# Altium project BE-PC_EXP_V100.PrjPcb (part 3 of 4)

## Sheet 15_SOLENOID 2.SchDoc
size 420 x 297 mm; SheetNumber: 24; SheetTotal: 29
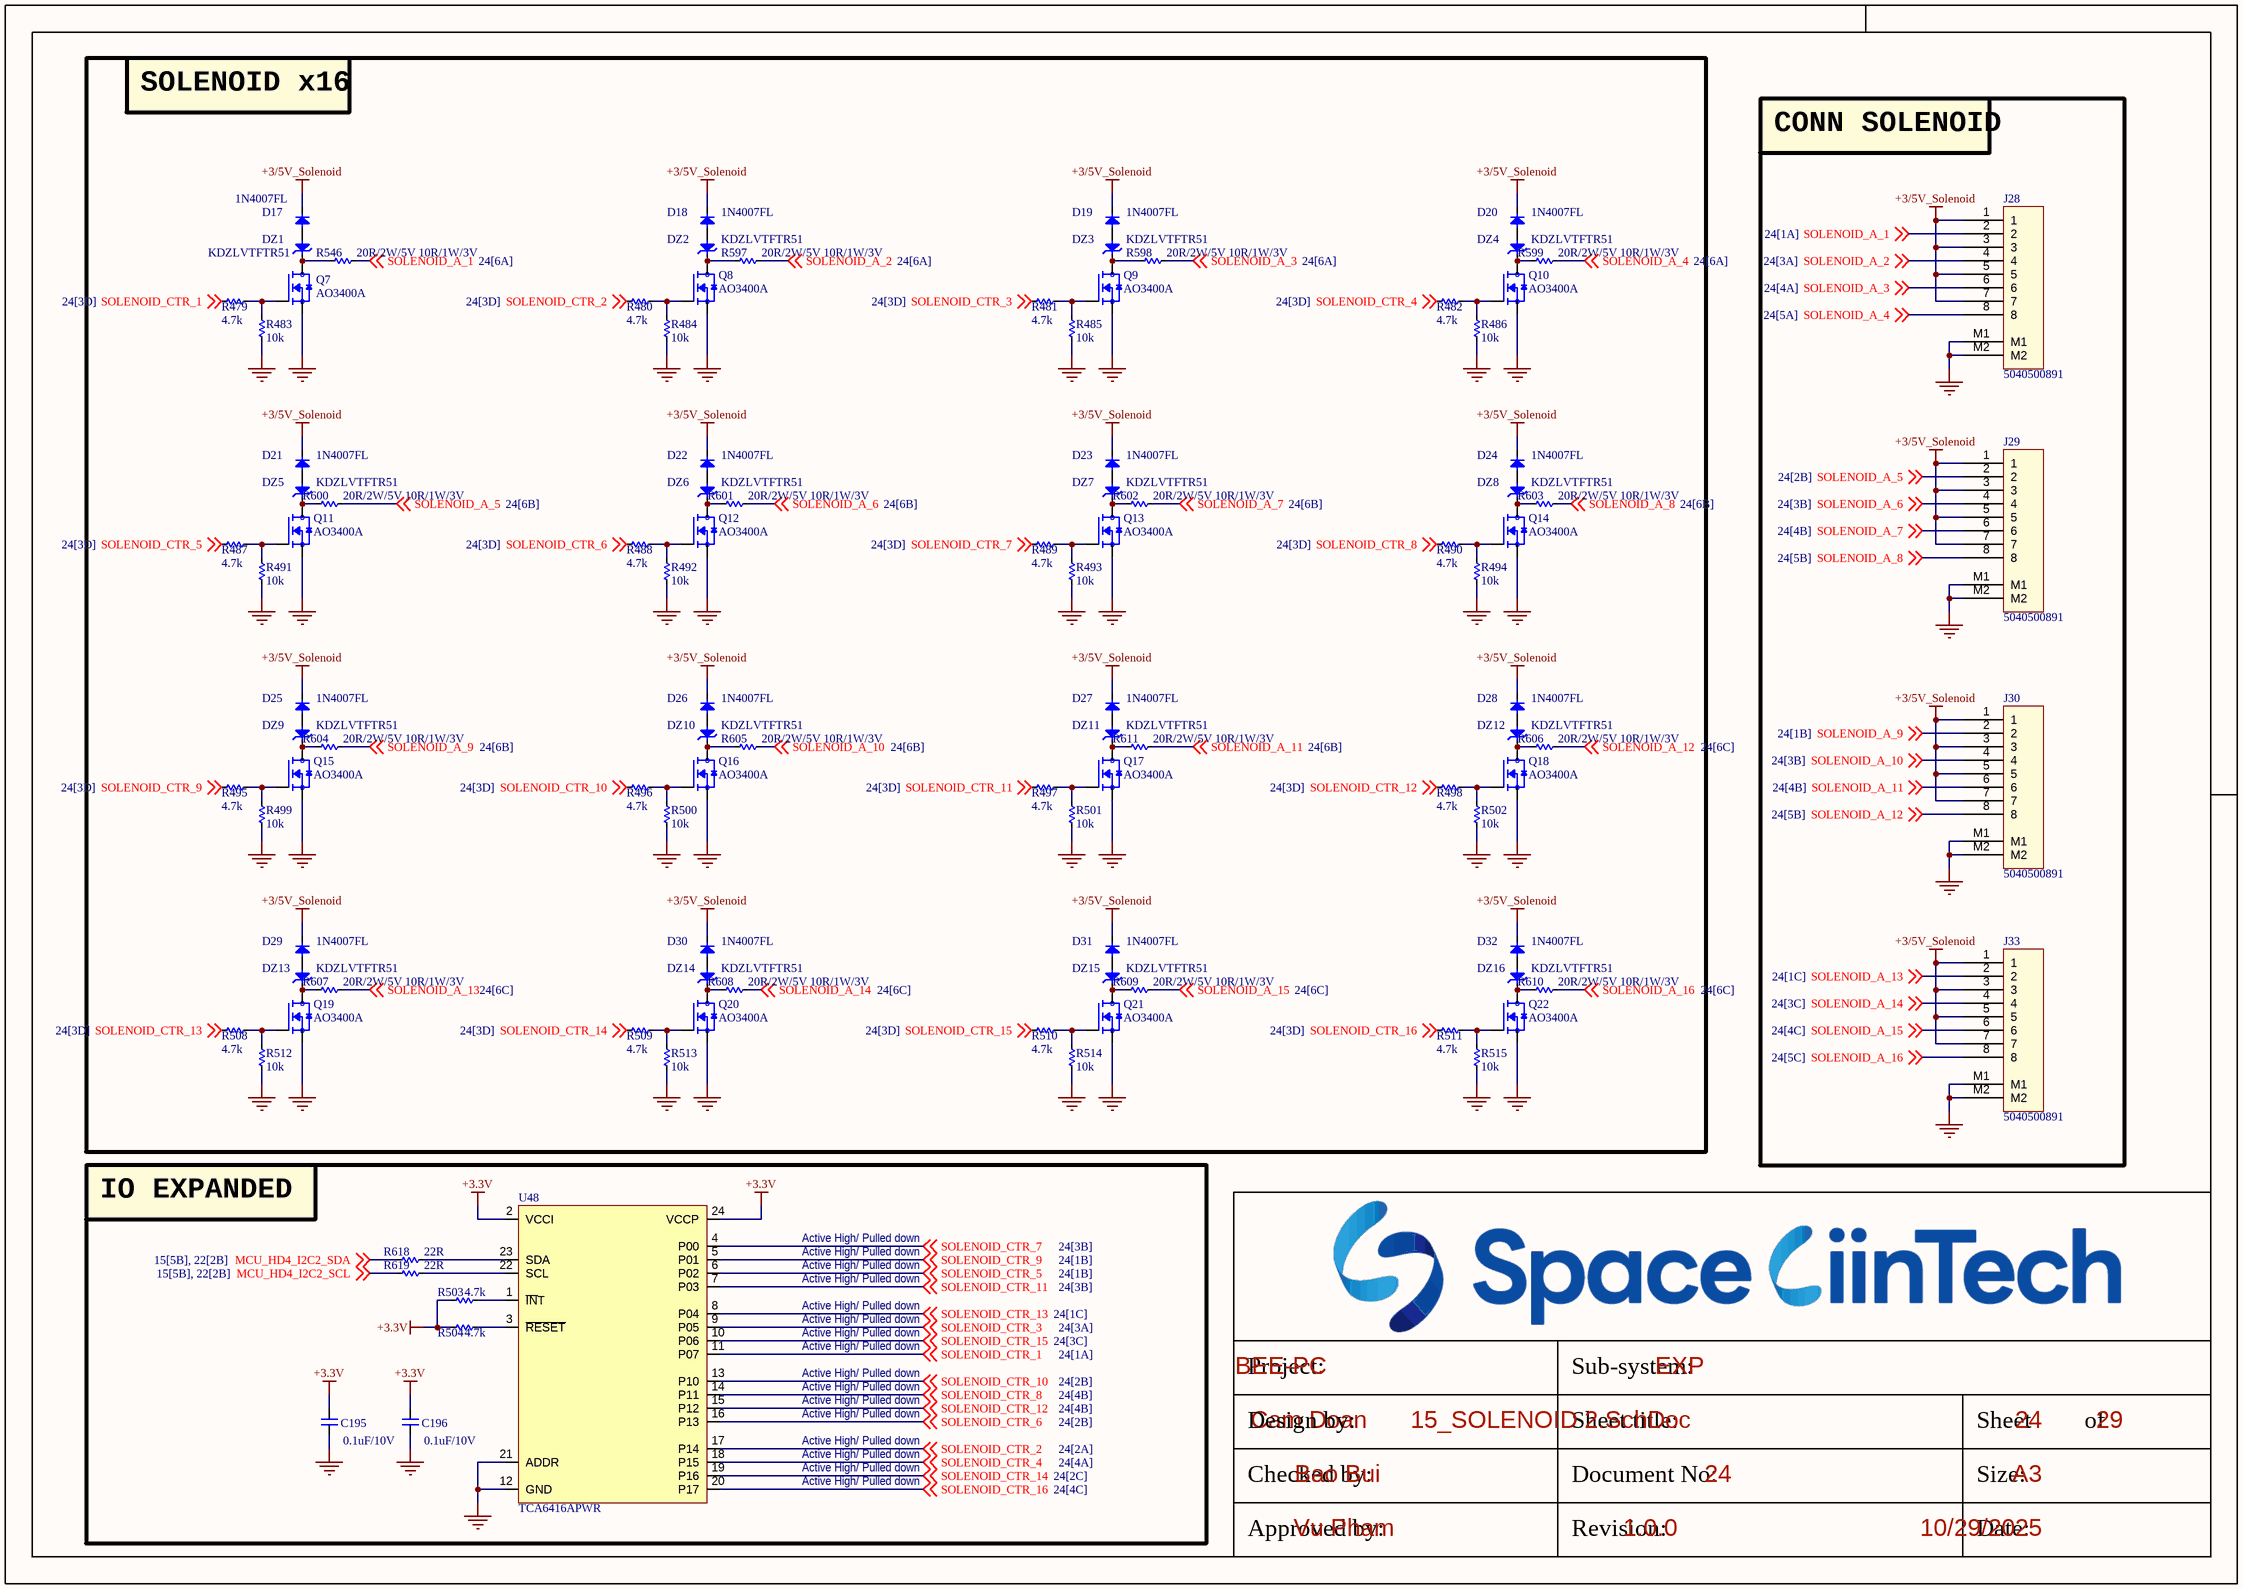
[diagram p25: 15_SOLENOID 2.SchDoc]

### Parts
C195  0.1uF/10V  [CAP_C_1005X60]
C196  0.1uF/10V  [CAP_C_1005X60]
D17  1N4007FL  [SOD3717X145N]
D18  1N4007FL  [SOD3717X145N]
D19  1N4007FL  [SOD3717X145N]
D20  1N4007FL  [SOD3717X145N]
D21  1N4007FL  [SOD3717X145N]
D22  1N4007FL  [SOD3717X145N]
D23  1N4007FL  [SOD3717X145N]
D24  1N4007FL  [SOD3717X145N]
D25  1N4007FL  [SOD3717X145N]
D26  1N4007FL  [SOD3717X145N]
D27  1N4007FL  [SOD3717X145N]
D28  1N4007FL  [SOD3717X145N]
D29  1N4007FL  [SOD3717X145N]
D30  1N4007FL  [SOD3717X145N]
D31  1N4007FL  [SOD3717X145N]
D32  1N4007FL  [SOD3717X145N]
DZ1  KDZLVTFTR51  [SOD3717X145N]
DZ2  KDZLVTFTR51  [SOD3717X145N]
DZ3  KDZLVTFTR51  [SOD3717X145N]
DZ4  KDZLVTFTR51  [SOD3717X145N]
DZ5  KDZLVTFTR51  [SOD3717X145N]
DZ6  KDZLVTFTR51  [SOD3717X145N]
DZ7  KDZLVTFTR51  [SOD3717X145N]
DZ8  KDZLVTFTR51  [SOD3717X145N]
DZ9  KDZLVTFTR51  [SOD3717X145N]
DZ10  KDZLVTFTR51  [SOD3717X145N]
DZ11  KDZLVTFTR51  [SOD3717X145N]
DZ12  KDZLVTFTR51  [SOD3717X145N]
DZ13  KDZLVTFTR51  [SOD3717X145N]
DZ14  KDZLVTFTR51  [SOD3717X145N]
DZ15  KDZLVTFTR51  [SOD3717X145N]
DZ16  KDZLVTFTR51  [SOD3717X145N]
J28  5040500891  [MOLEX_5040500891]
J29  5040500891  [MOLEX_5040500891]
J30  5040500891  [MOLEX_5040500891]
J33  5040500891  [MOLEX_5040500891]
Q7  AO3400A  [SOT95P240X120-3N]
Q8  AO3400A  [SOT95P240X120-3N]
Q9  AO3400A  [SOT95P240X120-3N]
Q10  AO3400A  [SOT95P240X120-3N]
Q11  AO3400A  [SOT95P240X120-3N]
Q12  AO3400A  [SOT95P240X120-3N]
Q13  AO3400A  [SOT95P240X120-3N]
Q14  AO3400A  [SOT95P240X120-3N]
Q15  AO3400A  [SOT95P240X120-3N]
Q16  AO3400A  [SOT95P240X120-3N]
Q17  AO3400A  [SOT95P240X120-3N]
Q18  AO3400A  [SOT95P240X120-3N]
Q19  AO3400A  [SOT95P240X120-3N]
Q20  AO3400A  [SOT95P240X120-3N]
Q21  AO3400A  [SOT95P240X120-3N]
Q22  AO3400A  [SOT95P240X120-3N]
R479  4.7k  [RES_C_1005X40]
R480  4.7k  [RES_C_1005X40]
R481  4.7k  [RES_C_1005X40]
R482  4.7k  [RES_C_1005X40]
R483  10k  [RES_C_1005X40]
R484  10k  [RES_C_1005X40]
R485  10k  [RES_C_1005X40]
R486  10k  [RES_C_1005X40]
R487  4.7k  [RES_C_1005X40]
R488  4.7k  [RES_C_1005X40]
R489  4.7k  [RES_C_1005X40]
R490  4.7k  [RES_C_1005X40]
R491  10k  [RES_C_1005X40]
R492  10k  [RES_C_1005X40]
R493  10k  [RES_C_1005X40]
R494  10k  [RES_C_1005X40]
R495  4.7k  [RES_C_1005X40]
R496  4.7k  [RES_C_1005X40]
R497  4.7k  [RES_C_1005X40]
R498  4.7k  [RES_C_1005X40]
R499  10k  [RES_C_1005X40]
R500  10k  [RES_C_1005X40]
R501  10k  [RES_C_1005X40]
R502  10k  [RES_C_1005X40]
R503  4.7k  [RES_C_1005X40]
R504  4.7k  [RES_C_1005X40]
R508  4.7k  [RES_C_1005X40]
R509  4.7k  [RES_C_1005X40]
R510  4.7k  [RES_C_1005X40]
R511  4.7k  [RES_C_1005X40]
R512  10k  [RES_C_1005X40]
R513  10k  [RES_C_1005X40]
R514  10k  [RES_C_1005X40]
R515  10k  [RES_C_1005X40]
R546  20R/2W/5V 10R/1W/3V  [RES_C_6331X65_N]
R597  20R/2W/5V 10R/1W/3V  [RES_C_6331X65_N]
R598  20R/2W/5V 10R/1W/3V  [RES_C_6331X65_N]
R599  20R/2W/5V 10R/1W/3V  [RES_C_6331X65_N]
R600  20R/2W/5V 10R/1W/3V  [RES_C_6331X65_N]
R601  20R/2W/5V 10R/1W/3V  [RES_C_6331X65_N]
R602  20R/2W/5V 10R/1W/3V  [RES_C_6331X65_N]
R603  20R/2W/5V 10R/1W/3V  [RES_C_6331X65_N]
R604  20R/2W/5V 10R/1W/3V  [RES_C_6331X65_N]
R605  20R/2W/5V 10R/1W/3V  [RES_C_6331X65_N]
R606  20R/2W/5V 10R/1W/3V  [RES_C_6331X65_N]
R607  20R/2W/5V 10R/1W/3V  [RES_C_6331X65_N]
R608  20R/2W/5V 10R/1W/3V  [RES_C_6331X65_N]
R609  20R/2W/5V 10R/1W/3V  [RES_C_6331X65_N]
R610  20R/2W/5V 10R/1W/3V  [RES_C_6331X65_N]
R611  20R/2W/5V 10R/1W/3V  [RES_C_6331X65_N]
R618  22R  [RES_C_1005X40]
R619  22R  [RES_C_1005X40]
U48  TCA6416APWR  [SOP65P440W-24N]

### Blocks framed on the sheet
SOLENOID x16: D17-D32 DZ1-DZ16 Q7-Q22 R479-R502 R508-R515 R546 R597-R611
CONN SOLENOID: J28-J30 J33
IO EXPANDED: C195 C196 R503 R504 R618 R619 U48

### Nets
+3.3V: C195.2 C196.2 R503.1 R504.1 U48.2(VCCI) U48.24(VCCP)
+3/5V_Solenoid: D17.1(K) D18.1(K) D19.1(K) D20.1(K) D21.1(K) D22.1(K) D23.1(K) D24.1(K) D25.1(K) D26.1(K) D27.1(K) D28.1(K) D29.1(K) D30.1(K) D31.1(K) D32.1(K) J28.1 J28.3 J28.5 J28.7 J29.1 J29.3 J29.5 J29.7 J30.1 J30.3 J30.5 J30.7 J33.1 J33.3 J33.5 J33.7
GND: C195.1 C196.1 J28.M1 J28.M2 J29.M1 J29.M2 J30.M1 J30.M2 J33.M1 J33.M2 Q7.2(S) Q8.2(S) Q9.2(S) Q10.2(S) Q11.2(S) Q12.2(S) Q13.2(S) Q14.2(S) Q15.2(S) Q16.2(S) Q17.2(S) Q18.2(S) Q19.2(S) Q20.2(S) Q21.2(S) Q22.2(S) R483.1 R484.1 R485.1 R486.1 R491.1 R492.1 R493.1 R494.1 R499.1 R500.1 R501.1 R502.1 R512.1 R513.1 R514.1 R515.1 U48.12(GND) U48.21(ADDR)
MCU_HD4_I2C2_SCL: R619.2 ; off-sheet MCU_HD4_I2C2_SCL
MCU_HD4_I2C2_SDA: R618.2 ; off-sheet MCU_HD4_I2C2_SDA
SOLENOID_A_1: J28.2 R546.1 ; off-sheet SOLENOID_A_1
SOLENOID_A_2: J28.4 R597.1 ; off-sheet SOLENOID_A_2
SOLENOID_A_3: J28.6 R598.1 ; off-sheet SOLENOID_A_3
SOLENOID_A_4: J28.8 R599.1 ; off-sheet SOLENOID_A_4
SOLENOID_A_5: J29.2 R600.1 ; off-sheet SOLENOID_A_5
SOLENOID_A_6: J29.4 R601.1 ; off-sheet SOLENOID_A_6
SOLENOID_A_7: J29.6 R602.1 ; off-sheet SOLENOID_A_7
SOLENOID_A_8: J29.8 R603.1 ; off-sheet SOLENOID_A_8
SOLENOID_A_9: J30.2 R604.1 ; off-sheet SOLENOID_A_9
SOLENOID_A_10: J30.4 R605.1 ; off-sheet SOLENOID_A_10
SOLENOID_A_11: J30.6 R611.1 ; off-sheet SOLENOID_A_11
SOLENOID_A_12: J30.8 R606.1 ; off-sheet SOLENOID_A_12
SOLENOID_A_13: J33.2 R607.1 ; off-sheet SOLENOID_A_13
SOLENOID_A_14: J33.4 R608.1 ; off-sheet SOLENOID_A_14
SOLENOID_A_15: J33.6 R609.1 ; off-sheet SOLENOID_A_15
SOLENOID_A_16: J33.8 R610.1 ; off-sheet SOLENOID_A_16
SOLENOID_CTR_1: R479.2 U48.11(P07) ; off-sheet SOLENOID_CTR_1
SOLENOID_CTR_2: R480.2 U48.17(P14) ; off-sheet SOLENOID_CTR_2
SOLENOID_CTR_3: R481.2 U48.9(P05) ; off-sheet SOLENOID_CTR_3
SOLENOID_CTR_4: R482.2 U48.18(P15) ; off-sheet SOLENOID_CTR_4
SOLENOID_CTR_5: R487.2 U48.6(P02) ; off-sheet SOLENOID_CTR_5
SOLENOID_CTR_6: R488.2 U48.16(P13) ; off-sheet SOLENOID_CTR_6
SOLENOID_CTR_7: R489.2 U48.4(P00) ; off-sheet SOLENOID_CTR_7
SOLENOID_CTR_8: R490.2 U48.14(P11) ; off-sheet SOLENOID_CTR_8
SOLENOID_CTR_9: R495.2 U48.5(P01) ; off-sheet SOLENOID_CTR_9
SOLENOID_CTR_10: R496.2 U48.13(P10) ; off-sheet SOLENOID_CTR_10
SOLENOID_CTR_11: R497.2 U48.7(P03) ; off-sheet SOLENOID_CTR_11
SOLENOID_CTR_12: R498.2 U48.15(P12) ; off-sheet SOLENOID_CTR_12
SOLENOID_CTR_13: R508.2 U48.8(P04) ; off-sheet SOLENOID_CTR_13
SOLENOID_CTR_14: R509.2 U48.19(P16) ; off-sheet SOLENOID_CTR_14
SOLENOID_CTR_15: R510.2 U48.10(P06) ; off-sheet SOLENOID_CTR_15
SOLENOID_CTR_16: R511.2 U48.20(P17) ; off-sheet SOLENOID_CTR_16
NetD17_2: D17.2(A) DZ1.2(A)
NetD18_2: D18.2(A) DZ2.2(A)
NetD19_2: D19.2(A) DZ3.2(A)
NetD20_2: D20.2(A) DZ4.2(A)
NetD21_2: D21.2(A) DZ5.2(A)
NetD22_2: D22.2(A) DZ6.2(A)
NetD23_2: D23.2(A) DZ7.2(A)
NetD24_2: D24.2(A) DZ8.2(A)
NetD25_2: D25.2(A) DZ9.2(A)
NetD26_2: D26.2(A) DZ10.2(A)
NetD27_2: D27.2(A) DZ11.2(A)
NetD28_2: D28.2(A) DZ12.2(A)
NetD29_2: D29.2(A) DZ13.2(A)
NetD30_2: D30.2(A) DZ14.2(A)
NetD31_2: D31.2(A) DZ15.2(A)
NetD32_2: D32.2(A) DZ16.2(A)
NetDZ1_1: DZ1.1(K) Q7.3(D) R546.2
NetDZ2_1: DZ2.1(K) Q8.3(D) R597.2
NetDZ3_1: DZ3.1(K) Q9.3(D) R598.2
NetDZ4_1: DZ4.1(K) Q10.3(D) R599.2
NetDZ5_1: DZ5.1(K) Q11.3(D) R600.2
NetDZ6_1: DZ6.1(K) Q12.3(D) R601.2
NetDZ7_1: DZ7.1(K) Q13.3(D) R602.2
NetDZ8_1: DZ8.1(K) Q14.3(D) R603.2
NetDZ9_1: DZ9.1(K) Q15.3(D) R604.2
NetDZ10_1: DZ10.1(K) Q16.3(D) R605.2
NetDZ11_1: DZ11.1(K) Q17.3(D) R611.2
NetDZ12_1: DZ12.1(K) Q18.3(D) R606.2
NetDZ13_1: DZ13.1(K) Q19.3(D) R607.2
NetDZ14_1: DZ14.1(K) Q20.3(D) R608.2
NetDZ15_1: DZ15.1(K) Q21.3(D) R609.2
NetDZ16_1: DZ16.1(K) Q22.3(D) R610.2
NetQ7_1: Q7.1(G) R479.1 R483.2
NetQ8_1: Q8.1(G) R480.1 R484.2
NetQ9_1: Q9.1(G) R481.1 R485.2
NetQ10_1: Q10.1(G) R482.1 R486.2
NetQ11_1: Q11.1(G) R487.1 R491.2
NetQ12_1: Q12.1(G) R488.1 R492.2
NetQ13_1: Q13.1(G) R489.1 R493.2
NetQ14_1: Q14.1(G) R490.1 R494.2
NetQ15_1: Q15.1(G) R495.1 R499.2
NetQ16_1: Q16.1(G) R496.1 R500.2
NetQ17_1: Q17.1(G) R497.1 R501.2
NetQ18_1: Q18.1(G) R498.1 R502.2
NetQ19_1: Q19.1(G) R508.1 R512.2
NetQ20_1: Q20.1(G) R509.1 R513.2
NetQ21_1: Q21.1(G) R510.1 R514.2
NetQ22_1: Q22.1(G) R511.1 R515.2
NetR503_2: R503.2 U48.1(~{IN}T)
NetR504_2: R504.2 U48.3(~{RESET})
NetR618_1: R618.1 U48.23(SDA)
NetR619_1: R619.1 U48.22(SCL)

### Notes on the sheet
- Active High/ Pulled down
- Project:
- Sub-system:
- Design by:
- Sheet title:
- Sheet
- of
- Checked by:
- Approved by:
- Revision:
- Document No:
- Size:
- Date:
- A3

### Library data of the parts
C195 C196 = _CAP_C_2: CAP CHIP
D17-D32 = Diode SMD: Default Diode; Code - JEDEC: DO-214-AB; Value: 1N5007; Published: 8-Jun-2000; Revision: July-2002: Re-released for DXP Platform.; Publisher: Altium Limited
DZ1-DZ16 = DIODE Zener: Zenner
J28-J30 J33 = Header 8x1_2M
Q7-Q22 = MOSFET_N: N-Channel 30 V 5.7A (Ta) 1.4W (Ta) Surface Mount SOT-23-3; MF: Alpha & Omega Semiconductor; SnapEDA_Link: https://www.snapeda.com/parts/AO3400A/Alpha/view-part/?ref=snap; Package: SOT-23 Alpha &amp; Omega Semiconductor Inc.; Value: *; MP: AO3400A; Check_prices: https://www.snapeda.com/parts/AO3400A/Alpha/view-part/?ref=eda
R479-R504 R508-R515 R546 R597-R611 R618 R619 = _RES_B_2: RES
U48 = IC_I2Cto16IO_TCA6416APWR

## Sheet MOUTING.SchDoc
size 420 x 297 mm; SheetNumber: 25; SheetTotal: 29
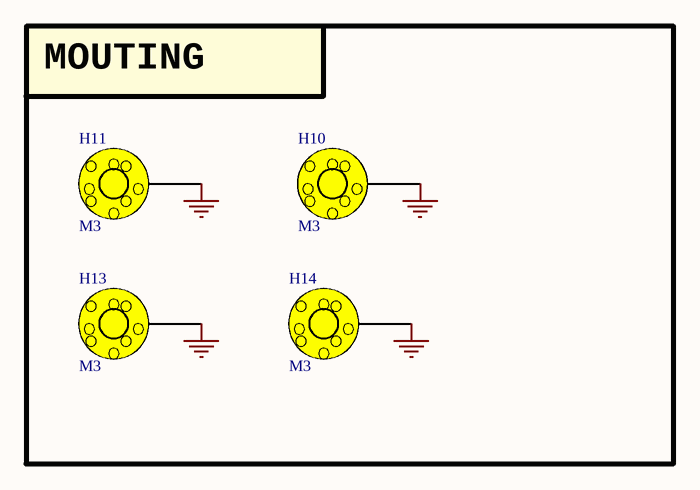
[diagram p26: MOUTING.SchDoc]

### Parts
H10  M3  [HEX-M3_NoVia]
H11  M3  [HEX-M3_NoVia]
H13  M3  [HEX-M3_NoVia]
H14  M3  [HEX-M3_NoVia]

### Blocks framed on the sheet
MOUTING: H10 H11 H13 H14

### Nets
GND: H10.1 H11.1 H13.1 H14.1

### Notes on the sheet
- Project:
- Sub-system:
- Design by:
- Sheet title:
- Sheet
- of
- Checked by:
- Approved by:
- Revision:
- Document No:
- Size:
- Date:
- A3

### Library data of the parts
H10 H11 H13 H14 = HEX-M3

## Sheet 06_SAMA7G54-PMIC.SchDoc
size 420 x 297 mm; SheetNumber: 26; SheetTotal: 29
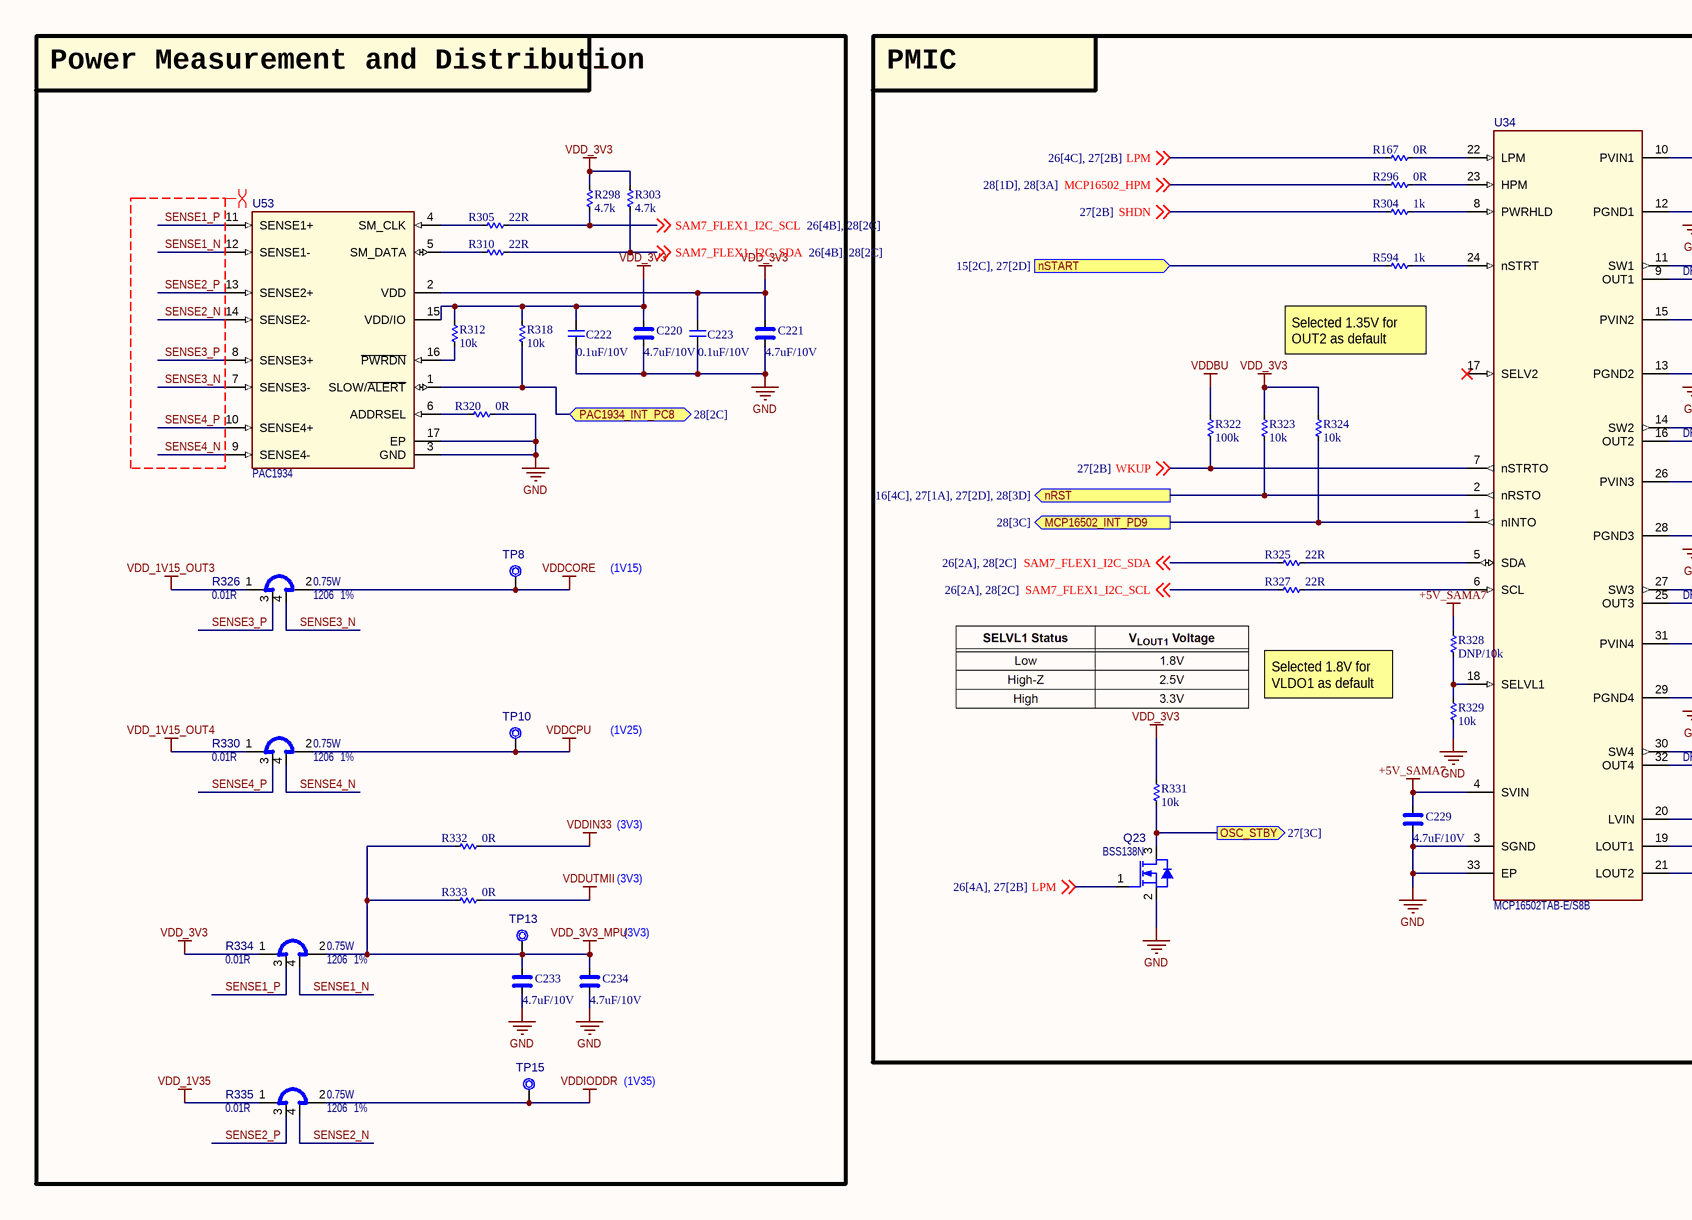
[diagram p27: 06_SAMA7G54-PMIC.SchDoc, left]
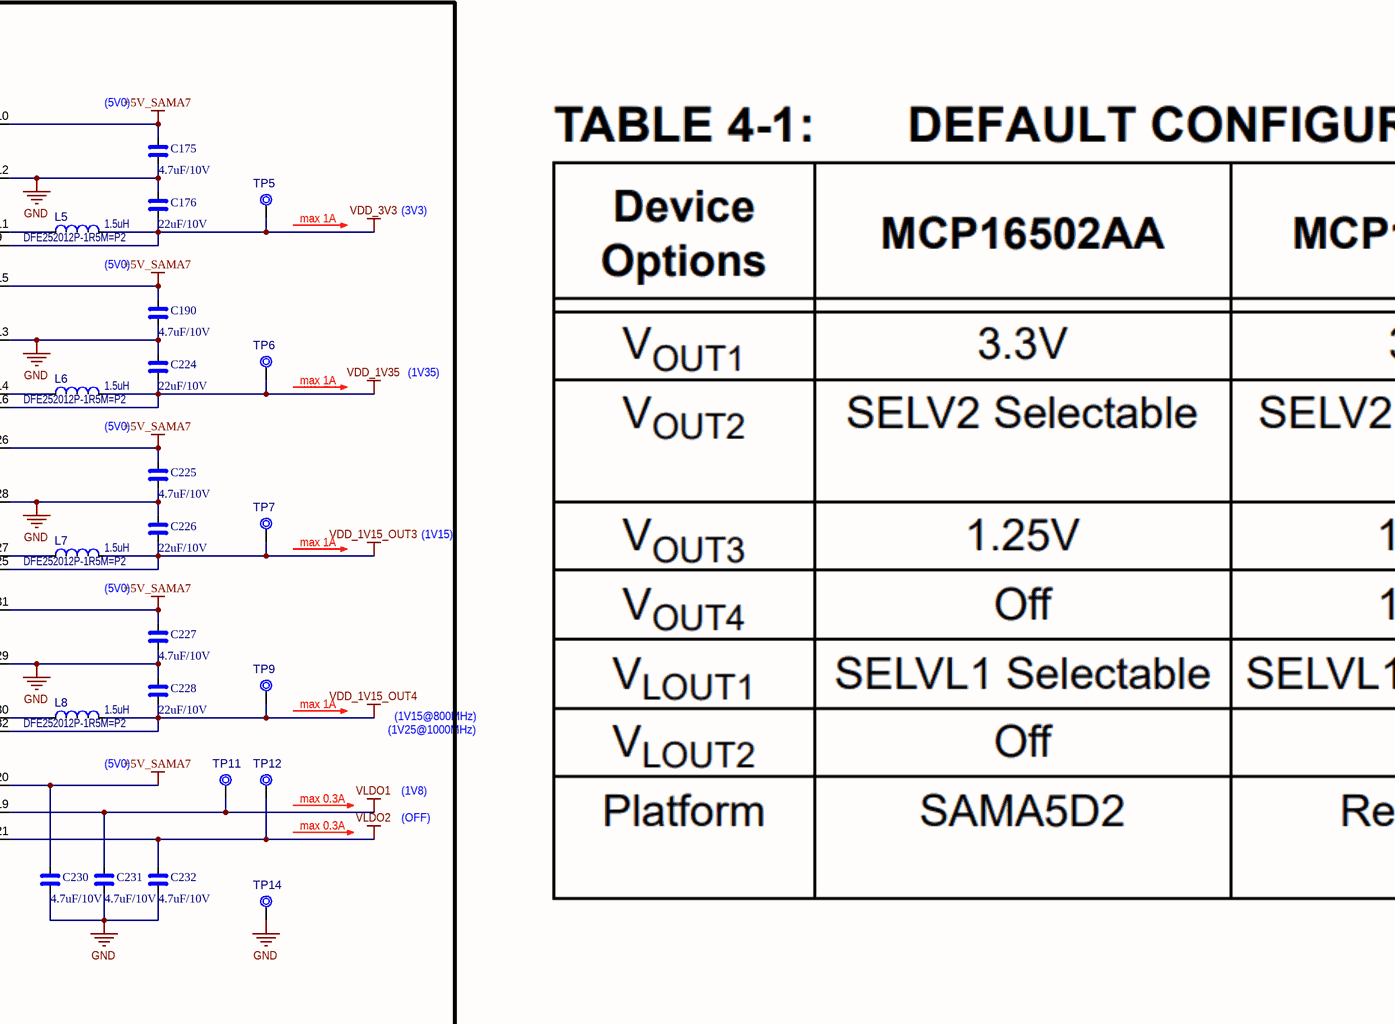
[diagram p28: 06_SAMA7G54-PMIC.SchDoc, middle]
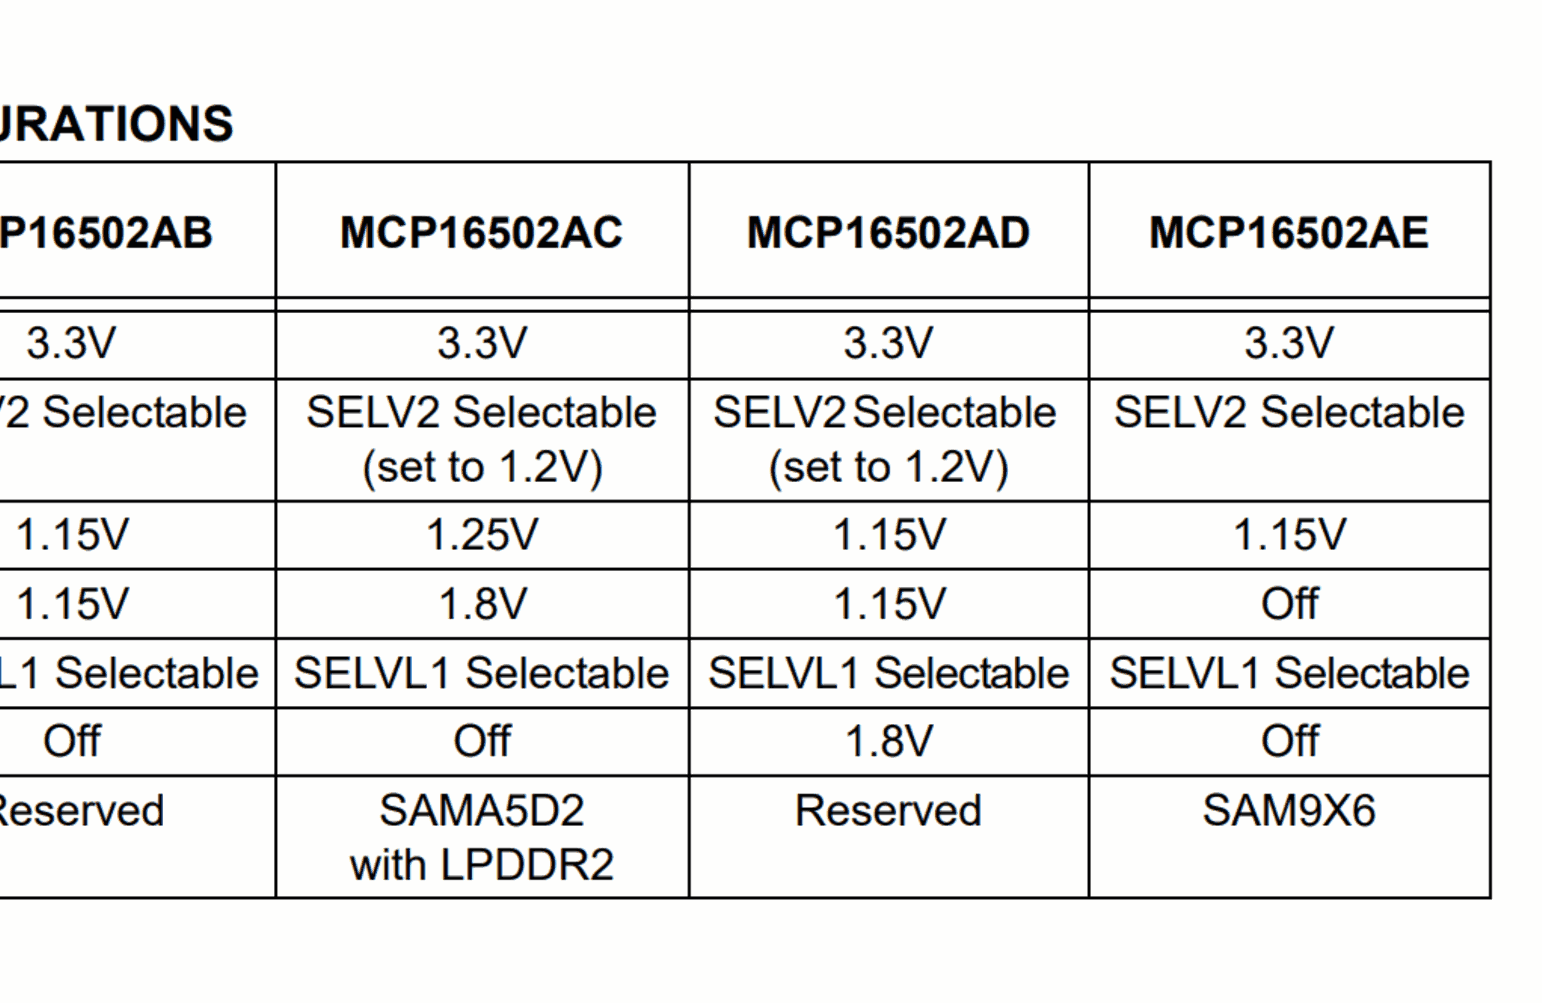
[diagram p29: 06_SAMA7G54-PMIC.SchDoc, right]

### Parts
C175  4.7uF/10V  [CAP_C_1005X50_L]
C176  22uF/10V  [CAP_C_1608X80]
C190  4.7uF/10V  [CAP_C_1005X50_L]
C220  4.7uF/10V  [CAP_C_1005X60]
C221  4.7uF/10V  [CAP_C_1005X60]
C222  0.1uF/10V  [CAP_C_1005X60]
C223  0.1uF/10V  [CAP_C_1005X60]
C224  22uF/10V  [CAP_C_1608X80]
C225  4.7uF/10V  [CAP_C_1005X50_L]
C226  22uF/10V  [CAP_C_1608X80]
C227  4.7uF/10V  [CAP_C_1005X50_L]
C228  22uF/10V  [CAP_C_1608X80]
C229  4.7uF/10V  [CAP_C_1005X50_L]
C230  4.7uF/10V  [CAP_C_1005X50_L]
C231  4.7uF/10V  [CAP_C_1005X50_L]
C232  4.7uF/10V  [CAP_C_1005X50_L]
C233  4.7uF/10V  [CAP_C_1005X60]
C234  4.7uF/10V  [CAP_C_1005X60]
L5  value 1.5uH  Manufacturer Part Number 1: DFE252012P-1R5M=P2  [IND_C_1008]  (hidden comment: Inductor)
L6  value 1.5uH  Manufacturer Part Number 1: DFE252012P-1R5M=P2  [IND_C_1008]  (hidden comment: Inductor)
L7  value 1.5uH  Manufacturer Part Number 1: DFE252012P-1R5M=P2  [IND_C_1008]  (hidden comment: Inductor)
L8  value 1.5uH  Manufacturer Part Number 1: DFE252012P-1R5M=P2  [IND_C_1008]  (hidden comment: Inductor)
Q23  value BSS138N  [SOT-23-3]  (hidden comment: Transistor MOS-N GSD)
R167  0R  [RES_C_1608X60]
R296  0R  [RES_C_1608X60]
R298  4.7k  [RES_C_1005X40]
R303  4.7k  [RES_C_1005X40]
R304  1k  [RES_C_1005X40]
R305  22R  [RES_C_1005X40]
R310  22R  [RES_C_1005X40]
R312  10k  [RES_C_1005X40]
R318  10k  [RES_C_1005X40]
R320  0R  [RES_C_1005X40]
R322  100k  [RES_C_1005X40]
R323  10k  [RES_C_1005X40]
R324  10k  [RES_C_1005X40]
R325  22R  [RES_C_0603X30]
R326  value 0.01R  Package: 1206  Tolerance: 1%  Power: 0.75W  [RES_C_1206_SHUNT]  (hidden comment: Shunt 4 Pin)
R327  22R  [RES_C_0603X30]
R328  DNP/10k  [RES_C_1005X40]
R329  10k  [RES_C_1005X40]
R330  value 0.01R  Package: 1206  Tolerance: 1%  Power: 0.75W  [RES_C_1206_SHUNT]  (hidden comment: Shunt 4 Pin)
R331  10k  [RES_C_1005X40]
R332  0R  [RES_C_1608X60]
R333  0R  [RES_C_1608X60]
R334  value 0.01R  Package: 1206  Tolerance: 1%  Power: 0.75W  [RES_C_1206_SHUNT]  (hidden comment: Shunt 4 Pin)
R335  value 0.01R  Package: 1206  Tolerance: 1%  Power: 0.75W  [RES_C_1206_SHUNT]  (hidden comment: Shunt 4 Pin)
R594  1k  [RES_C_1005X40]
TP5  Test Point No BOM  [Testpoint_80]  (value not drawn)  (no BOM)
TP6  Test Point No BOM  [Testpoint_80]  (value not drawn)  (no BOM)
TP7  Test Point No BOM  [Testpoint_80]  (value not drawn)  (no BOM)
TP8  Test Point No BOM  [Testpoint_80]  (value not drawn)  (no BOM)
TP9  Test Point No BOM  [Testpoint_80]  (value not drawn)  (no BOM)
TP10  Test Point No BOM  [Testpoint_80]  (value not drawn)  (no BOM)
TP11  Test Point No BOM  [Testpoint_80]  (value not drawn)  (no BOM)
TP12  Test Point No BOM  [Testpoint_80]  (value not drawn)  (no BOM)
TP13  Test Point No BOM  [Testpoint_80]  (value not drawn)  (no BOM)
TP14  Test Point No BOM  [Testpoint_80]  (value not drawn)  (no BOM)
TP15  Test Point No BOM  [Testpoint_80]  (value not drawn)  (no BOM)
U34  MCP16502TAB-E/S8B  [QFN-32_5X5_EP3.7X3.7]
U53  value PAC1934  [UQFN-16_4X4_EP2.6X2.6]  (hidden comment: PAC1934 UQFN-16)

### Blocks framed on the sheet
Power Measurement and Distribution: C220-C223 C233 C234 R298 R303 R305 R310 R312 R318 R320 R326 R330 R332-R335 TP8 TP10 TP13 TP15 U53
PMIC: C175 C176 C190 C224-C232 L5-L8 Q23 R167 R296 R304 R322-R325 R327-R329 R331 R594 TP5-TP7 TP9 TP11 TP12 TP14 U34

### Ports
MCP16502_INT_PD9 (out, see 28[3C]), nRST (out, see 16[4C], 27[1A], 27[2D], 28[3D]), nSTART (in, see 15[2C], 27[2D]), OSC_STBY (out, see 27[3C]), PAC1934_INT_PC8 (bidir, see 28[2C])

### Nets
+5V_SAMA7: C175.1 C190.1 C225.1 C227.1 C229.1 C230.1 R328.2 U34.4(SVIN) U34.10(PVIN1) U34.15(PVIN2) U34.20(LVIN) U34.26(PVIN3) U34.31(PVIN4)
GND: C175.2 C176.1 C190.2 C220.2 C221.2 C222.2 C223.2 C224.1 C225.2 C226.1 C227.2 C228.1 C229.2 C230.2 C231.2 C232.2 C233.2 C234.2 Q23.2(S) R320.2 R329.1 TP14.1 U34.3(SGND) U34.12(PGND1) U34.13(PGND2) U34.28(PGND3) U34.29(PGND4) U34.33(EP) U53.3(GND) U53.17(EP)
VDD_1V15_OUT3: C226.2 L7.2(F) R326.1 TP7.1 U34.25(OUT3)
VDD_1V15_OUT4: C228.2 L8.2(F) R330.1 TP9.1 U34.32(OUT4)
VDD_1V35: C224.2 L6.2(F) R335.1 TP6.1 U34.16(OUT2)
VDD_3V3: C176.2 C220.1 C221.1 C222.1 C223.1 L5.2(F) R298.1 R303.1 R312.1 R318.1 R323.2 R324.2 R331.2 R334.1 TP5.1 U34.9(OUT1) U53.2(VDD) U53.15(VDD/IO)
VDD_3V3_MPU: C233.1 C234.1 R332.2 R333.2 R334.2 TP13.1
VDDBU: R322.2
VDDCORE: R326.2 TP8.1
VDDCPU: R330.2 TP10.1
VDDIN33: R332.1
VDDIODDR: R335.2 TP15.1
VDDUTMII: R333.1
VLDO1: C231.1 TP11.1 U34.19(LOUT1)
VLDO2: C232.1 TP12.1 U34.21(LOUT2)
LPM: Q23.1(G) R167.2 ; off-sheet LPM
MCP16502_HPM: R296.2 ; off-sheet MCP16502_HPM
SAM7_FLEX1_I2C_SCL: R298.2 R305.1 R327.2 ; off-sheet SAM7_FLEX1_I2C_SCL  [project net _PC10]
SAM7_FLEX1_I2C_SDA: R303.2 R310.1 R325.2 ; off-sheet SAM7_FLEX1_I2C_SDA  [project net _PC9]
SENSE1_N: R334.4 U53.12(SENSE1-)
SENSE1_P: R334.3 U53.11(SENSE1+)
SENSE2_N: R335.4 U53.14(SENSE2-)
SENSE2_P: R335.3 U53.13(SENSE2+)
SENSE3_N: R326.4 U53.7(SENSE3-)
SENSE3_P: R326.3 U53.8(SENSE3+)
SENSE4_N: R330.4 U53.9(SENSE4-)
SENSE4_P: R330.3 U53.10(SENSE4+)
SHDN: R304.1 ; off-sheet SHDN
WKUP: R322.1 U34.7(nSTRTO) ; off-sheet WKUP
NetC288_1: R594.1 ; port nSTART
NetC290_2: R323.1 U34.2(nRSTO) ; port nRST
NetL5_1: L5.1(S) U34.11(SW1)
NetL6_1: L6.1(S) U34.14(SW2)
NetL7_1: L7.1(S) U34.27(SW3)
NetL8_1: L8.1(S) U34.30(SW4)
NetQ23_3: Q23.3(D) R331.1 ; port OSC_STBY
NetR167_1: R167.1 U34.22(LPM)
NetR296_1: R296.1 U34.23(HPM)
NetR304_2: R304.2 U34.8(PWRHLD)
NetR305_2: R305.2 U53.4(SM_CLK)
NetR310_2: R310.2 U53.5(SM_DATA)
NetR312_2: R312.2 U53.16(~{PWRDN})
NetR318_2: R318.2 U53.1(SLOW/~{ALERT}) ; port PAC1934_INT_PC8
NetR320_1: R320.1 U53.6(ADDRSEL)
NetR324_1: R324.1 U34.1(nINTO) ; port MCP16502_INT_PD9
NetR325_1: R325.1 U34.5(SDA)
NetR327_1: R327.1 U34.6(SCL)
NetR328_1: R328.1 R329.2 U34.18(SELVL1)
NetR594_2: R594.2 U34.24(nSTRT)

Not connected (* = marked no-connect by the designer): U34 17(SELV2)*

### Layout directives
differential pair; differential pair class DIFF: SENSE1_N, SENSE1_P, SENSE2_N, SENSE2_P, SENSE3_N, SENSE3_P, SENSE4_N, SENSE4_P

### Notes on the sheet
- (near C175) (5V0)
- (5V0)
- (near TP5) max 1A
- (3V3)
- (near R594) Selected 1.35V for OUT2 as default
- (near TP6) max 1A
- (1V35)
- (1V15)
- (near TP7) max 1A
- Selected 1.8V for VLDO1 as default
- (1V25)
- (near TP9) max 1A
- (1V25@1000MHz)
- (1V15@800MHz)
- (near L8) (5V0)
- (near TP12) max 0.3A
- (1V8)
- (OFF)
- (near C234) (3V3)
- Project:
- Sub-system:
- Design by:
- Sheet title:
- Sheet
- of
- Checked by:
- Approved by:
- Revision:
- Document No:
- Size:
- Date:
- A3

### Library data of the parts
C175 C176 C190 C220 C221 C224-C234 = _CAP_C_High_2: CAP CHIP High Value
C222 C223 = _CAP_C_2: CAP CHIP
L5-L8 = IND1335: Manufacturer 1: Murata Electronics North America; Description_: INDUCTOR 1.5uH 3.5A 20% SMD 1008; Dev Tools Status: Design; Owner: Razvan Cristescu; DCR: 0.06R; RMS Current: 3.5A; Test Frequency: 1MHz; Populated: YES; MCHP-ID: IND1335; Revision: A; Symbol: Inductor; Status: MCL Design; ComponentLink1URL: https://chn-vm-apps.microchip.com/mchprepo/parts/Datasheets/m_dfe252012p.pdf; ComponentLink1Description: SVN Datasheet; ComponentLink2URL: C:\ALTIUM_WORK\00001_MCHP-CDB\Datasheets\m_dfe252012p.pdf; ComponentLink2Description: Local Datasheet; ComponentLink3URL: C:\ALTIUM_WORK\00001_MCHP-CDB\Library\LibraryRefs\Inductor.SchLib; ComponentLink3Description: Open Symbol; ComponentLink4URL: C:\ALTIUM_WORK\00001_MCHP-CDB\Library\Footprints\IND_C_1008.PcbLib; ComponentLink4Description: Open Footprint; ComponentLink5Description: Open Footprint 2; ComponentLink6Description: Open Footprint 3; ComponentLink7Description: Open Footprint 4; Package: 1008; Type: Inductor; Category: Inductor; Supplier 1: Digi-Key; Supplier Part Number 1: 490-10648-6-ND; Quantity Override: 1
Q23 = TRA1223: Transistor MOS; Manufacturer 1: Infineon Technologies; Manufacturer Part Number 1: BSS138NH6327XTSA2; Description_: TRANS FET N-CH BSS138N 60V 230mA SOT23-3; Dev Tools Status: Production; Type: FET; Current: 230mA; Drain to Source Voltage: 60V; Gate to Source Voltage: 20V; Power: 0.36W; Owner: Dragos Danaila; Populated: YES; MCHP-ID: TRA1223; Revision: 1; Symbol: Transistor MOS-N GSD; Status: MCL Design; Package: SOT23-3; ComponentLink1URL: https://chn-vm-apps.microchip.com/mchprepo/parts/Datasheets/Infineon-BSS138N-DS-v02_86-en.pdf; ComponentLink1Description: SVN Datasheet; ComponentLink2URL: C:\ALTIUM_WORK\00001_MCHP-CDB\Datasheets\Infineon-BSS138N-DS-v02_86-en.pdf; ComponentLink2Description: Local Datasheet; ComponentLink3URL: C:\ALTIUM_WORK\00001_MCHP-CDB\Library\LibraryRefs\Transistor MOS-N GSD.SchLib; ComponentLink3Description: Open Symbol; ComponentLink4URL: C:\ALTIUM_WORK\00001_MCHP-CDB\Library\Footprints\SOT-23-3.PcbLib; ComponentLink4Description: Open Footprint; ComponentLink5Description: Open Footprint 2; ComponentLink6Description: Open Footprint 3; ComponentLink7Description: Open Footprint 4; Operating Temperature: -55C to +150C; Category: Transistor; Voltage: 60V; Supplier 1: Digi-Key; Supplier Part Number 1: BSS138NH6327XTSA2CT-ND; Quantity Override: 1
R167 R296 R298 R303-R305 R310 R312 R318 R320 R322-R325 R327-R329 R331-R333 R594 = _RES_B_2: RES
R326 R330 R334 R335 = RSMT1316: Shunt; Manufacturer 1: SUSUMU; Manufacturer Part Number 1: KRL1632E-M-R010-F-T5; Description_: RES SHUNT MF 0.01R 1% 0.75W SMD 1206; Dev Tools Status: Design; Temperature Coeffcient: 50ppm/C; Current: 8A; Owner: Ciprian Abramov; Populated: YES; MCHP-ID: RSMT1316; Revision: 1; Symbol: Shunt 4 Pin; Status: MCL Design; ComponentLink1URL: https://chn-vm-apps.microchip.com/mchprepo/parts/Datasheets/n_catalog_partition09_en.pdf; ComponentLink1Description: SVN Datasheet; ComponentLink2URL: C:\ALTIUM_WORK\00001_MCHP-CDB\Datasheets\n_catalog_partition09_en.pdf; ComponentLink2Description: Local Datasheet; ComponentLink3URL: C:\ALTIUM_WORK\00001_MCHP-CDB\Library\LibraryRefs\Shunt 4 Pin.SchLib; ComponentLink3Description: Open Symbol; ComponentLink4URL: C:\ALTIUM_WORK\00001_MCHP-CDB\Library\Footprints\RES_C_1206_SHUNT.PcbLib; ComponentLink4Description: Open Footprint; ComponentLink5Description: Open Footprint 2; ComponentLink6Description: Open Footprint 3; ComponentLink7Description: Open Footprint 4; Operating Temperature: -55C to +155C; Category: Resistor; Type: RES SMD; Composition: MF; Supplier 1: Digi-Key; Supplier Part Number 1: 408-1570-1-ND; Quantity Override: 1
TP5-TP15 = CON1759: Test Point; Value: TP PAD PCB 1mm; Description_: CON TP PAD PCB 1mm SMD; Dev Tools Status: Design; Owner: Cristian Papuc; Populated: YES; MCHP-ID: CON1759; Revision: A; Symbol: Test Point No BOM; Status: MCL Design; ComponentLink1Description: SVN Datasheet; ComponentLink2Description: Local Datasheet; ComponentLink3URL: C:\ALTIUM_WORK\00001_MCHP-CDB\Library\LibraryRefs\Test Point No BOM.SchLib; ComponentLink3Description: Open Symbol; ComponentLink4URL: C:\ALTIUM_WORK\00001_MCHP-CDB\Library\Footprints\TP_1mm_SMD.PcbLib; ComponentLink4Description: Open Footprint; ComponentLink5Description: Open Footprint 2; ComponentLink6Description: Open Footprint 3; ComponentLink7Description: Open Footprint 4; Type: Test Point; Category: Connector; Quantity Override: 1
U34 = MIC8878: Manufacturer 1: Microchip Technology; Populated: YES; Description_: MCHP ANALOG PMIC SWITCHER Buck ADJ MCP16502TAB-E/S8B QFN-32 for SAMA7G5 MPU with LPDDR/DDR2/DDR3; Dev Tools Status: Design; Owner: Dragos Danaila; MCHP-ID: MIC8878; Value: MCP16502TAB-E/S8B; Symbol: MCP16502 QFN-32; Type: Switcher; Status: MCL Design; Revision: 1; Category: MCHP-Analog; ComponentLink1Description: SVN Datasheet; ComponentLink2Description: Local Datasheet; ComponentLink3URL: C:\ALTIUM_WORK\00001_MCHP-CDB\Library\LibraryRefs\MCP16502 QFN-32.SchLib; ComponentLink3Description: Open Symbol; ComponentLink4URL: C:\ALTIUM_WORK\00001_MCHP-CDB\Library\Footprints\QFN-32_5X5_EP3.7X3.7.PcbLib; ComponentLink4Description: Open Footprint; ComponentLink5Description: Open Footprint 2; ComponentLink6Description: Open Footprint 3; ComponentLink7Description: Open Footprint 4; Manufacturer Part Number 1: MCP16502TAB-E/S8B; Supplier 1: Digi-Key; Supplier Part Number 1: 150-MCP16502TAB-E/S8BCT-ND; Quantity Override: 1; ComponentLink2URL: C:\ALTIUM_WORK\00001_MCHP-CDB\Datasheets\MCP16502-High-Performance-PMIC-for-SAMA5DX-SAM9X6-MPUs-Data-Sheet-DS20006275B.pdf
U53 = MIC8883: Manufacturer 1: Microchip Technology; Manufacturer Part Number 1: PAC1934T-I/JQ; Description_: MCHP ANALOG POWER CURRENT SENSE MONITOR PAC1934T-I/JQ UQFN-16; Dev Tools Status: Design; Owner: Ciprian Abramov; Populated: YES; MCHP-ID: MIC8883; Symbol: PAC1934 UQFN-16; Type: Power/Current Sensor; Status: MCL Design; Revision: 1; Category: MCHP-Analog; ComponentLink1Description: SVN Datasheet; ComponentLink2Description: Local Datasheet; ComponentLink3URL: C:\ALTIUM_WORK\00001_MCHP-CDB\Library\LibraryRefs\PAC1934 UQFN-16.SchLib; ComponentLink3Description: Open Symbol; ComponentLink4URL: C:\ALTIUM_WORK\00001_MCHP-CDB\Library\Footprints\UQFN-16_4X4_EP2.6X2.6.PcbLib; ComponentLink4Description: Open Footprint; ComponentLink5Description: Open Footprint 2; ComponentLink6Description: Open Footprint 3; ComponentLink7Description: Open Footprint 4; Supplier 1: Digi-Key; Supplier Part Number 1: PAC1934T-I/JQCT-ND; Quantity Override: 1

## Sheet 06_SAMA7G54-MPU.SchDoc
size 420 x 297 mm; SheetNumber: 27; SheetTotal: 29
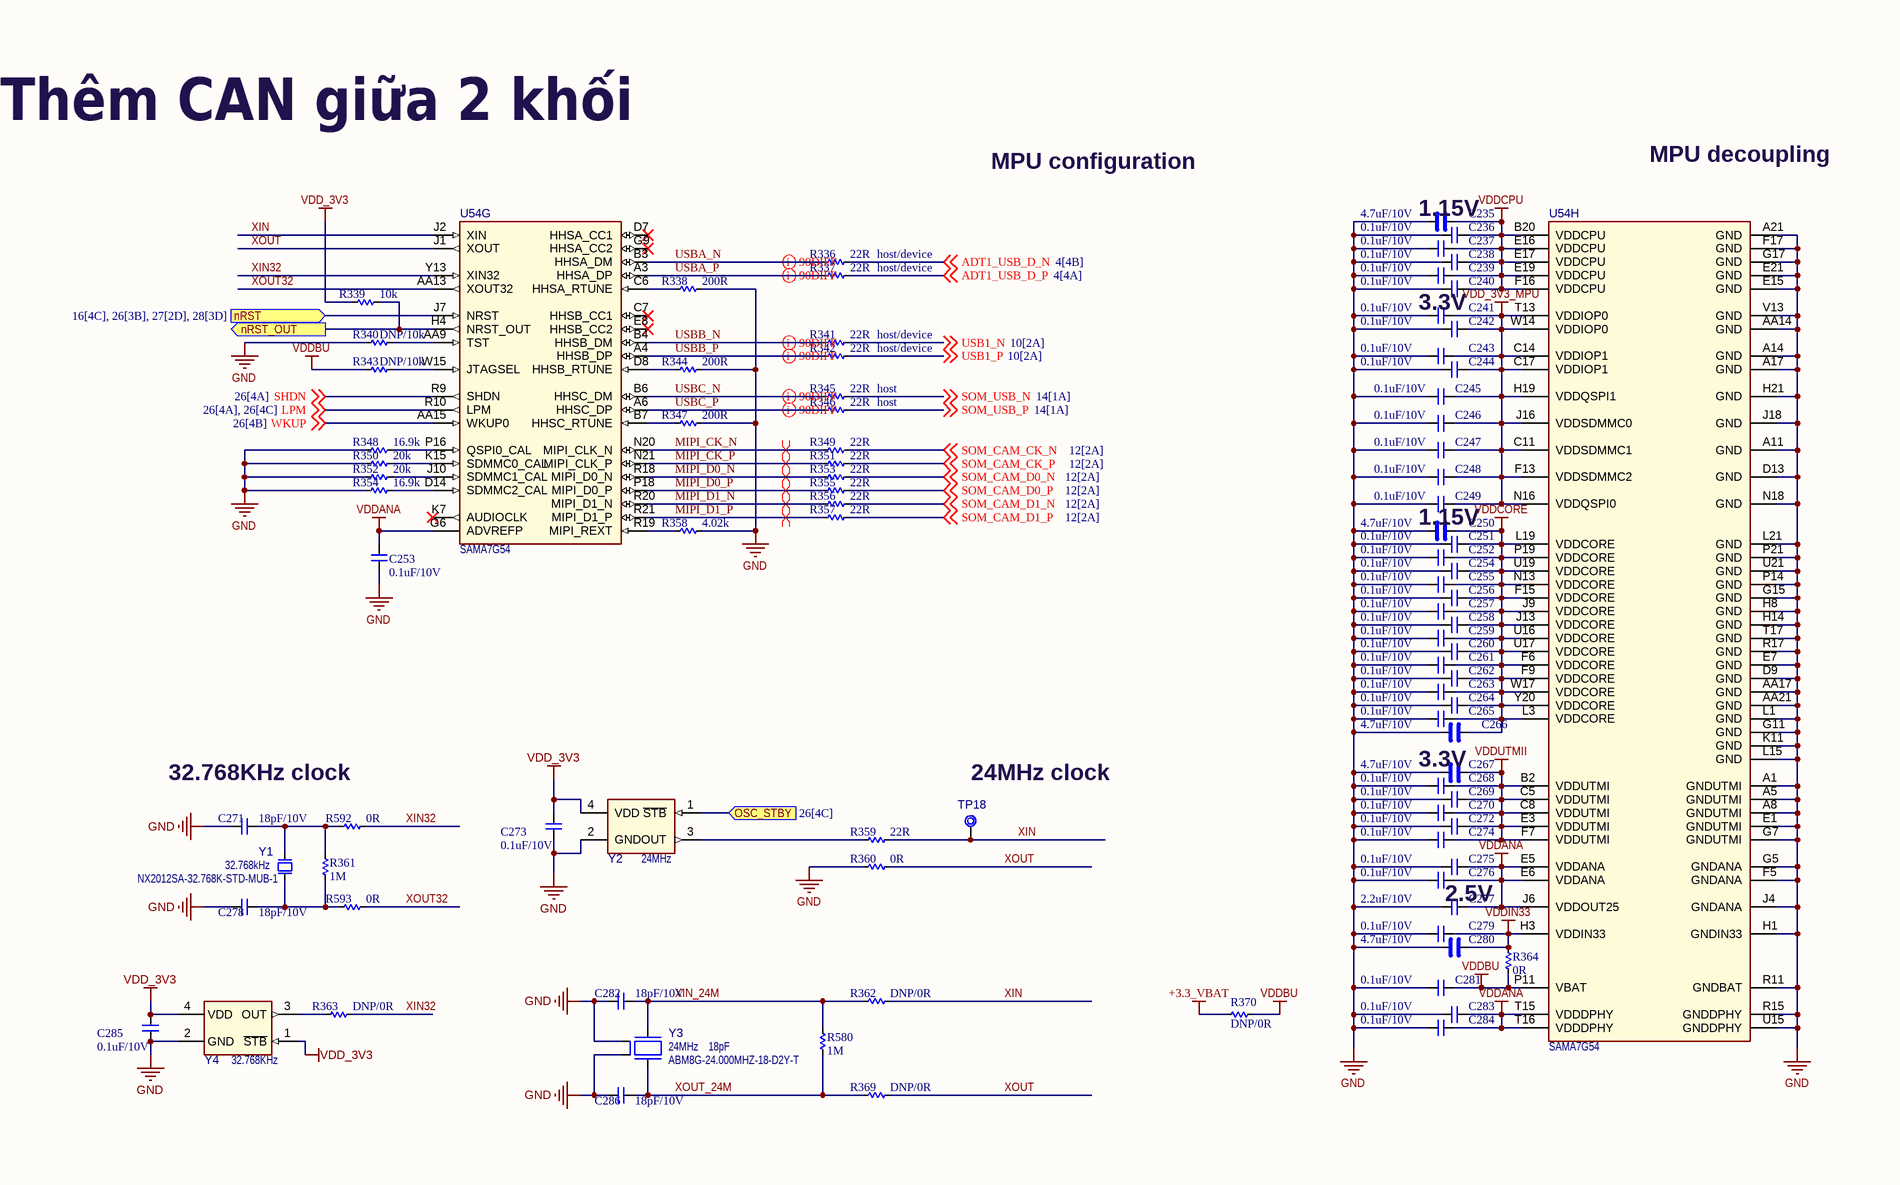
[diagram p30: 06_SAMA7G54-MPU.SchDoc, top left]
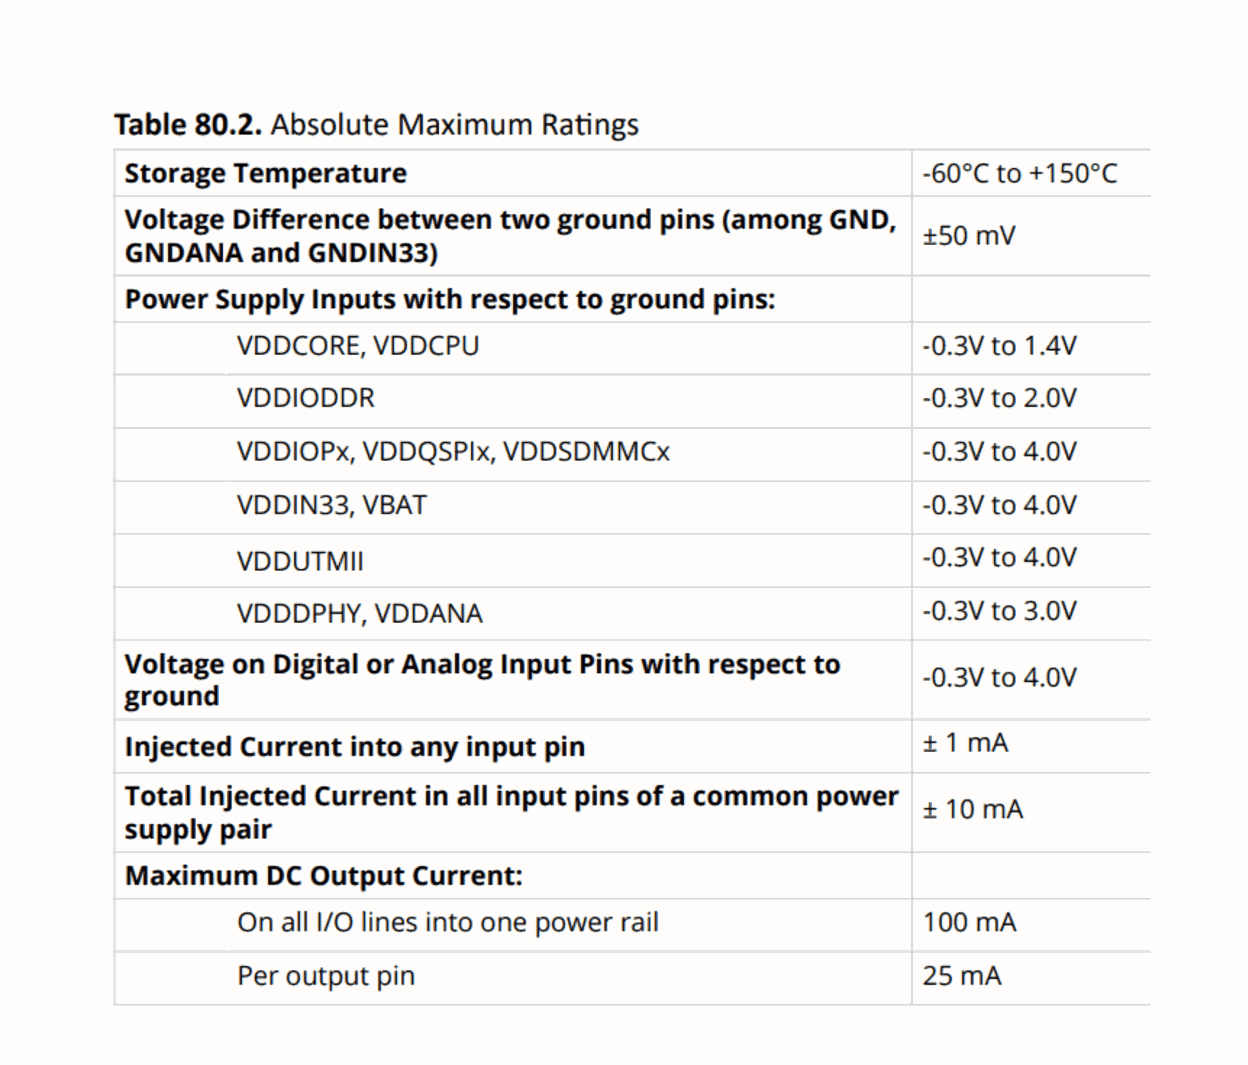
[diagram p31: 06_SAMA7G54-MPU.SchDoc, top right]
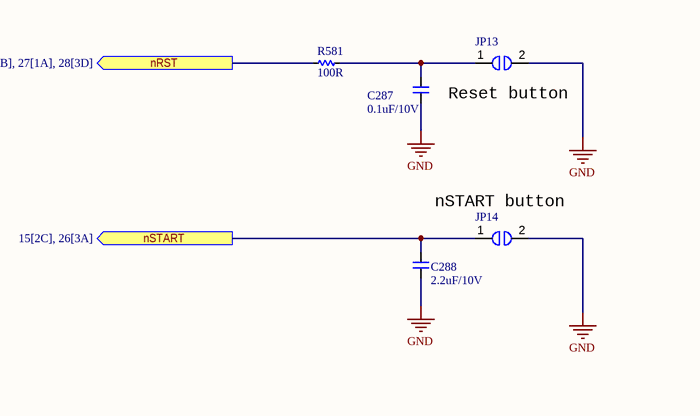
[diagram p32: 06_SAMA7G54-MPU.SchDoc, bottom left]
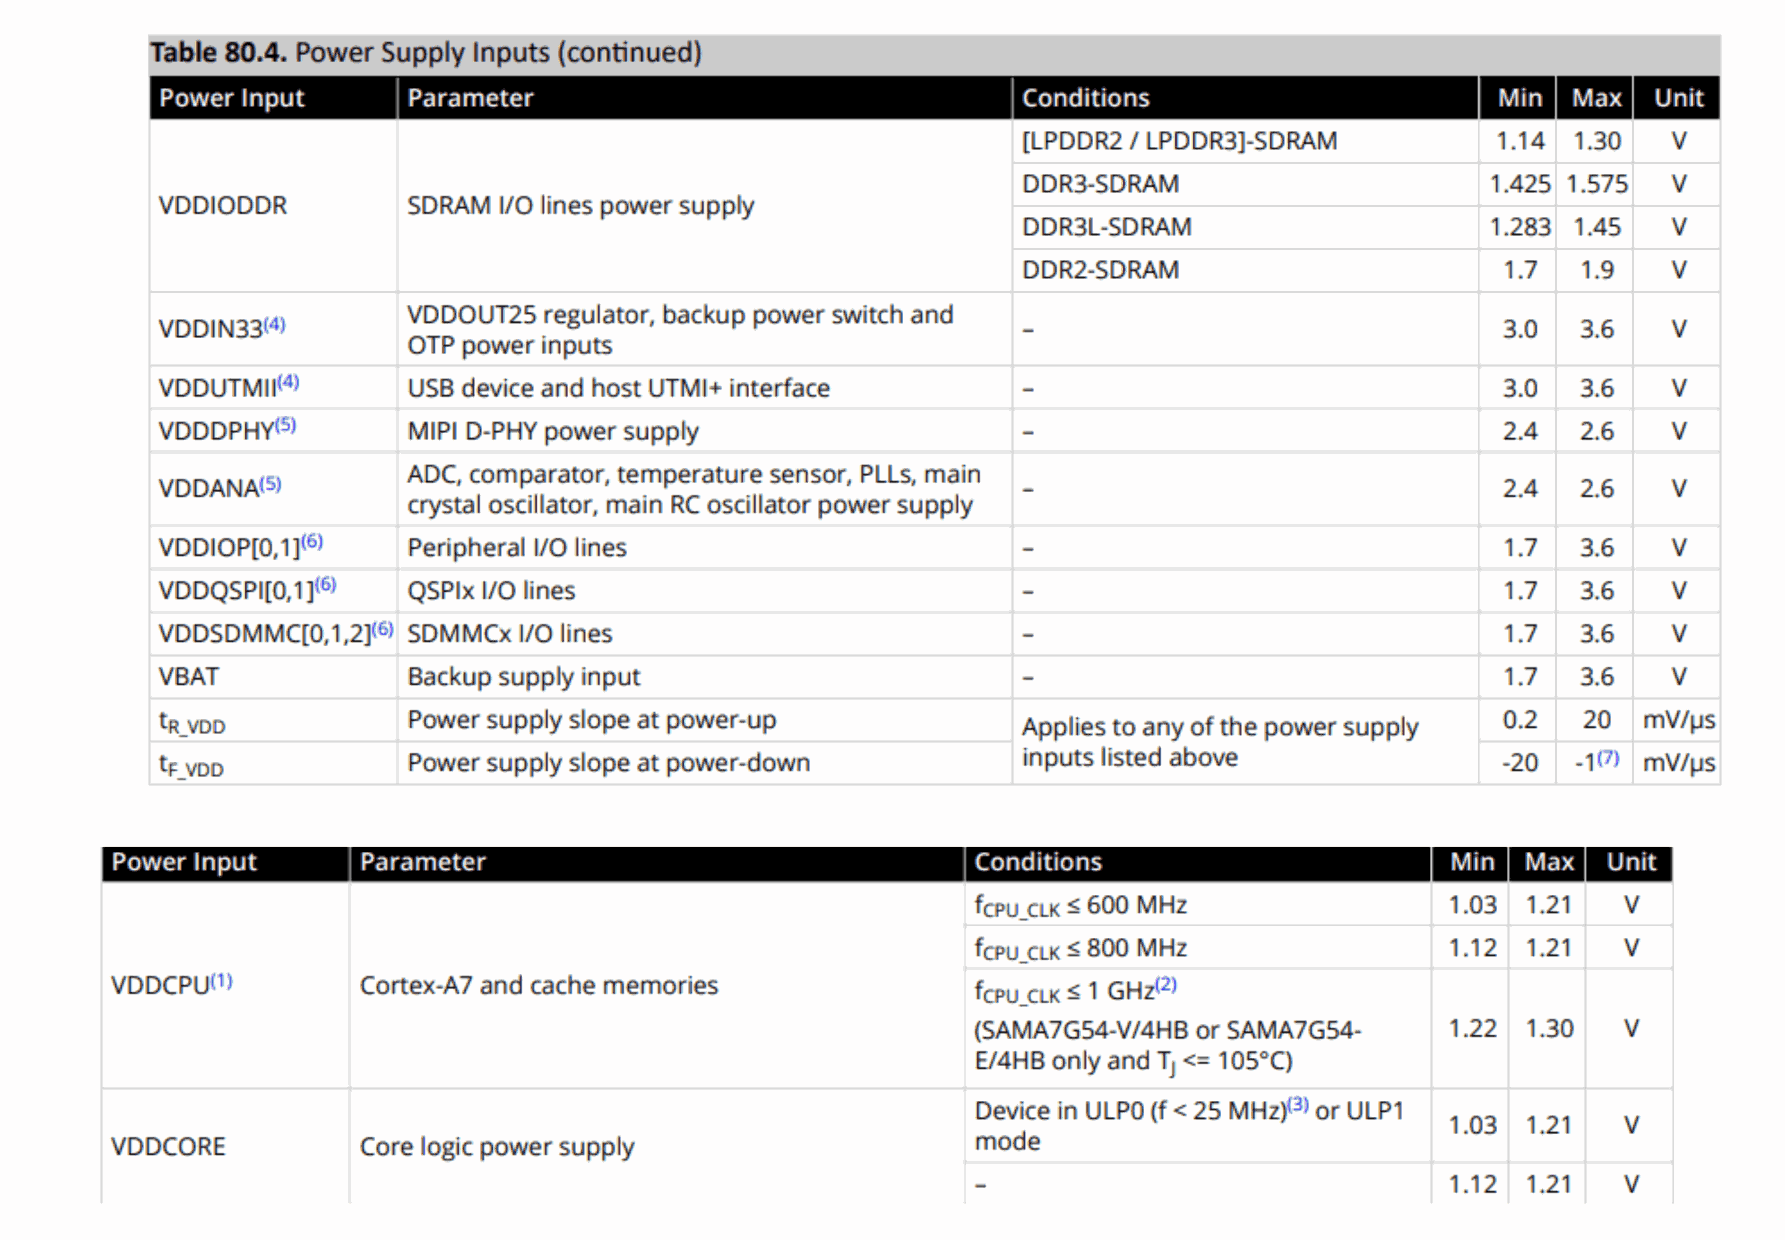
[diagram p33: 06_SAMA7G54-MPU.SchDoc, bottom right]

### Parts
C235  4.7uF/10V  [CAP_C_1005X60]
C236  0.1uF/10V  [CAP_C_0603x30]
C237  0.1uF/10V  [CAP_C_0603x30]
C238  0.1uF/10V  [CAP_C_0603x30]
C239  0.1uF/10V  [CAP_C_0603x30]
C240  0.1uF/10V  [CAP_C_0603x30]
C241  0.1uF/10V  [CAP_C_0603x30]
C242  0.1uF/10V  [CAP_C_0603x30]
C243  0.1uF/10V  [CAP_C_0603x30]
C244  0.1uF/10V  [CAP_C_0603x30]
C245  0.1uF/10V  [CAP_C_0603x30]
C246  0.1uF/10V  [CAP_C_0603x30]
C247  0.1uF/10V  [CAP_C_0603x30]
C248  0.1uF/10V  [CAP_C_0603x30]
C249  0.1uF/10V  [CAP_C_0603x30]
C250  4.7uF/10V  [CAP_C_1005X60]
C251  0.1uF/10V  [CAP_C_0603x30]
C252  0.1uF/10V  [CAP_C_0603x30]
C253  0.1uF/10V  [CAP_C_0603x30]
C254  0.1uF/10V  [CAP_C_0603x30]
C255  0.1uF/10V  [CAP_C_0603x30]
C256  0.1uF/10V  [CAP_C_0603x30]
C257  0.1uF/10V  [CAP_C_0603x30]
C258  0.1uF/10V  [CAP_C_0603x30]
C259  0.1uF/10V  [CAP_C_0603x30]
C260  0.1uF/10V  [CAP_C_0603x30]
C261  0.1uF/10V  [CAP_C_0603x30]
C262  0.1uF/10V  [CAP_C_0603x30]
C263  0.1uF/10V  [CAP_C_0603x30]
C264  0.1uF/10V  [CAP_C_0603x30]
C265  0.1uF/10V  [CAP_C_0603x30]
C266  4.7uF/10V  [CAP_C_1005X60]
C267  4.7uF/10V  [CAP_C_1005X60]
C268  0.1uF/10V  [CAP_C_0603x30]
C269  0.1uF/10V  [CAP_C_0603x30]
C270  0.1uF/10V  [CAP_C_0603x30]
C271  18pF/10V  [CAP_C_1005X60]
C272  0.1uF/10V  [CAP_C_0603x30]
C273  0.1uF/10V  [CAP_C_1005X60]
C274  0.1uF/10V  [CAP_C_0603x30]
C275  0.1uF/10V  [CAP_C_0603x30]
C276  0.1uF/10V  [CAP_C_0603x30]
C277  2.2uF/10V  [CAP_C_1005X50_L]
C278  18pF/10V  [CAP_C_1005X60]
C279  0.1uF/10V  [CAP_C_0603x30]
C280  4.7uF/10V  [CAP_C_1005X60]
C281  0.1uF/10V  [CAP_C_0603x30]
C282  18pF/10V  [CAP_C_1005X60]
C283  0.1uF/10V  [CAP_C_0603x30]
C284  0.1uF/10V  [CAP_C_0603x30]
C285  0.1uF/10V  [CAP_C_1005X60]
C286  18pF/10V  [CAP_C_1005X60]
C287  0.1uF/10V  [CAP_C_1005X60]
C288  2.2uF/10V  [CAP_C_1005X50_L]
JP13  (no value)  [TESTPOINT_SHORT_120X100_60]
JP14  (no value)  [TESTPOINT_SHORT_120X100_60]
R336  22R  [RES_C_0603X30]
R337  22R  [RES_C_0603X30]
R338  200R  [RES_C_0603X30]
R339  10k  [RES_C_1005X40]
R340  DNP/10k  [RES_C_1005X40]
R341  22R  [RES_C_0603X30]
R342  22R  [RES_C_0603X30]
R343  DNP/10k  [RES_C_1005X40]
R344  200R  [RES_C_0603X30]
R345  22R  [RES_C_0603X30]
R346  22R  [RES_C_0603X30]
R347  200R  [RES_C_0603X30]
R348  16.9k  [RES_C_0603X30]
R349  22R  [RES_C_0603X30]
R350  20k  [RES_C_0603X30]
R351  22R  [RES_C_0603X30]
R352  20k  [RES_C_0603X30]
R353  22R  [RES_C_0603X30]
R354  16.9k  [RES_C_0603X30]
R355  22R  [RES_C_0603X30]
R356  22R  [RES_C_0603X30]
R357  22R  [RES_C_0603X30]
R358  4.02k  [RES_C_0603X30]
R359  22R  [RES_C_1005X40]
R360  0R  [RES_C_1005X40]
R361  1M  [RES_C_1005X40]
R362  DNP/0R  [RES_C_1005X40]
R363  DNP/0R  [RES_C_1005X40]
R364  0R  [RES_C_1005X40]
R369  DNP/0R  [RES_C_1005X40]
R370  DNP/0R  [RES_C_1005X40]
R580  1M  [RES_C_1005X40]
R581  100R  [RES_C_1005X40]
R592  0R  [RES_C_1005X40]
R593  0R  [RES_C_1005X40]
TP18  Test Point No BOM  [Testpoint_80]  (value not drawn)  (no BOM)
U54  SAMA7G54  [TFBGA-343_14x14]  (parts G,H of 8)
Y1  value 32.768kHz  Manufacturer Part Number 1: NX2012SA-32.768K-STD-MUB-1  [CRYSTAL_NX2012SA]  (hidden comment: Crystal 2 Pins)
Y2  value 24MHz  [DFN-4_2.5x2]  (hidden comment: DSC10xx DFN-4)
Y3  value 24MHz  Load Capacitance: 18pF  Manufacturer Part Number 1: ABM8G-24.000MHZ-18-D2Y-T  [CRYSTAL_ABM8G]  (hidden comment: Crystal 4 Pins)
Y4  value 32.768KHz  [DFN-4_2x1.6]  (hidden comment: DSC60xx DFN-4_LGA-4)

### Ports
nRST (in, see 16[4C], 26[3B], 27[2D], 28[3D]), nRST (out, see 16[4C], 26[3B], 27[1A], 28[3D]), nRST_OUT (out), nSTART (out, see 15[2C], 26[3A]), OSC_STBY (in, see 26[4C])

### Nets
+3.3_VBAT: R370.1
GND: C235.2 C236.2 C237.2 C238.2 C239.2 C240.2 C241.2 C242.2 C243.2 C244.2 C245.2 C246.2 C247.2 C248.2 C249.2 C250.2 C251.2 C252.2 C253.1 C254.2 C255.2 C256.2 C257.2 C258.2 C259.2 C260.2 C261.2 C262.2 C263.2 C264.2 C265.2 C266.2 C267.2 C268.2 C269.2 C270.2 C271.2 C272.2 C273.1 C274.2 C275.2 C276.2 C277.2 C278.2 C279.2 C280.2 C281.2 C282.2 C283.2 C284.2 C285.1 C286.2 C287.1 C288.2 JP13.2 JP14.2 R338.1 R340.2 R344.1 R347.1 R348.2 R350.2 R352.2 R354.2 R358.1 R360.1 U54.A1(GNDUTMI) U54.A5(GNDUTMI) U54.A8(GNDUTMI) U54.A11(GND) U54.A14(GND) U54.A17(GND) U54.A21(GND) U54.AA14(GND) U54.AA17(GND) U54.AA21(GND) U54.D9(GND) U54.D13(GND) U54.E1(GNDUTMI) U54.E7(GND) U54.E15(GND) U54.E21(GND) U54.F5(GNDANA) U54.F17(GND) U54.G5(GNDANA) U54.G7(GNDUTMI) U54.G11(GND) U54.G15(GND) U54.G17(GND) U54.H1(GNDIN33) U54.H8(GND) U54.H14(GND) U54.H21(GND) U54.J4(GNDANA) U54.J18(GND) U54.K11(GND) U54.L1(GND) U54.L15(GND) U54.L21(GND) U54.N18(GND) U54.P14(GND) U54.P21(GND) U54.R11(GNDBAT) U54.R15(GNDDPHY) U54.R17(GND) U54.T17(GND) U54.U15(GNDDPHY) U54.U21(GND) U54.V13(GND) Y2.2(GND) Y3.2(GND) Y3.4(GND) Y4.2(GND)
VDD_3V3: C273.2 C285.2 R339.2 Y2.4(VDD) Y4.1(~{STB}) Y4.4(VDD)
VDD_3V3_MPU: C241.1 C242.1 C243.1 C244.1 C245.1 C246.1 C247.1 C248.1 C249.1 U54.C11(VDDSDMMC1) U54.C14(VDDIOP1) U54.C17(VDDIOP1) U54.F13(VDDSDMMC2) U54.H19(VDDQSPI1) U54.J16(VDDSDMMC0) U54.N16(VDDQSPI0) U54.T13(VDDIOP0) U54.W14(VDDIOP0)
VDDANA: C253.2 C275.1 C276.1 C277.1 C283.1 C284.1 U54.E5(VDDANA) U54.E6(VDDANA) U54.G6(ADVREFP) U54.J6(VDDOUT25) U54.T15(VDDDPHY) U54.T16(VDDDPHY)
VDDBU: C281.1 R343.2 R364.2 R370.2 U54.P11(VBAT)
VDDCORE: C250.1 C251.1 C252.1 C254.1 C255.1 C256.1 C257.1 C258.1 C259.1 C260.1 C261.1 C262.1 C263.1 C264.1 C265.1 C266.1 U54.F6(VDDCORE) U54.F9(VDDCORE) U54.F15(VDDCORE) U54.J9(VDDCORE) U54.J13(VDDCORE) U54.L3(VDDCORE) U54.L19(VDDCORE) U54.N13(VDDCORE) U54.P19(VDDCORE) U54.U16(VDDCORE) U54.U17(VDDCORE) U54.U19(VDDCORE) U54.W17(VDDCORE) U54.Y20(VDDCORE)
VDDCPU: C235.1 C236.1 C237.1 C238.1 C239.1 C240.1 U54.B20(VDDCPU) U54.E16(VDDCPU) U54.E17(VDDCPU) U54.E19(VDDCPU) U54.F16(VDDCPU)
VDDIN33: C279.1 C280.1 R364.1 U54.H3(VDDIN33)
VDDUTMII: C267.1 C268.1 C269.1 C270.1 C272.1 C274.1 U54.B2(VDDUTMI) U54.C5(VDDUTMI) U54.C8(VDDUTMI) U54.E3(VDDUTMI) U54.F7(VDDUTMI)
ADT1_USB_D_N: R336.1 ; off-sheet ADT1_USB_D_N
ADT1_USB_D_P: R337.1 ; off-sheet ADT1_USB_D_P
LPM: U54.R10(LPM) ; off-sheet LPM
MIPI_CK_N: R349.2 U54.N20(MIPI_CLK_N)
MIPI_CK_P: R351.2 U54.N21(MIPI_CLK_P)
MIPI_D0_N: R353.2 U54.R18(MIPI_D0_N)
MIPI_D0_P: R355.2 U54.P18(MIPI_D0_P)
MIPI_D1_N: R356.2 U54.R20(MIPI_D1_N)
MIPI_D1_P: R357.2 U54.R21(MIPI_D1_P)
SHDN: U54.R9(SHDN) ; off-sheet SHDN
SOM_CAM_CK_N: R349.1 ; off-sheet SOM_CAM_CK_N
SOM_CAM_CK_P: R351.1 ; off-sheet SOM_CAM_CK_P
SOM_CAM_D0_N: R353.1 ; off-sheet SOM_CAM_D0_N
SOM_CAM_D0_P: R355.1 ; off-sheet SOM_CAM_D0_P
SOM_CAM_D1_N: R356.1 ; off-sheet SOM_CAM_D1_N
SOM_CAM_D1_P: R357.1 ; off-sheet SOM_CAM_D1_P
SOM_USB_N: R345.1 ; off-sheet SOM_USB_N
SOM_USB_P: R346.1 ; off-sheet SOM_USB_P
USB1_N: R341.1 ; off-sheet USB1_N
USB1_P: R342.1 ; off-sheet USB1_P
USBA_N: R336.2 U54.B3(HHSA_DM)
USBA_P: R337.2 U54.A3(HHSA_DP)
USBB_N: R341.2 U54.B4(HHSB_DM)
USBB_P: R342.2 U54.A4(HHSB_DP)
USBC_N: R345.2 U54.B6(HHSC_DM)
USBC_P: R346.2 U54.A6(HHSC_DP)
WKUP: U54.AA15(WKUP0) ; off-sheet WKUP
XIN: R359.2 R362.2 TP18.1 U54.J2(XIN)
XIN32: R363.2 R592.2 U54.Y13(XIN32)
XIN_24M: C282.1 R362.1 R580.1 Y3.3(Osc2)
XOUT: R360.2 R369.2 U54.J1(XOUT)
XOUT32: R593.2 U54.AA13(XOUT32)
XOUT_24M: C286.1 R369.1 R580.2 Y3.1(Osc1)
NetC271_1: C271.1 R361.1 R592.1 Y1.2(Osc2)
NetC278_1: C278.1 R361.2 R593.1 Y1.1(Osc1)
NetC287_2: C287.2 JP13.1 R581.2
NetC288_1: C288.1 JP14.1 ; port nSTART
NetC290_2: R581.1 U54.J7(NRST) ; port nRST
NetQ23_3: Y2.1(~{STB}) ; port OSC_STBY
NetR338_2: R338.2 U54.C6(HHSA_RTUNE)
NetR339_1: R339.1 U54.H4(NRST_OUT) ; port nRST_OUT
NetR340_1: R340.1 U54.AA9(TST)
NetR343_1: R343.1 U54.W15(JTAGSEL)
NetR344_2: R344.2 U54.D8(HHSB_RTUNE)
NetR347_2: R347.2 U54.B7(HHSC_RTUNE)
NetR348_1: R348.1 U54.P16(QSPI0_CAL)
NetR350_1: R350.1 U54.K15(SDMMC0_CAL)
NetR352_1: R352.1 U54.J10(SDMMC1_CAL)
NetR354_1: R354.1 U54.D14(SDMMC2_CAL)
NetR358_2: R358.2 U54.R19(MIPI_REXT)
NetR359_1: R359.1 Y2.3(OUT)
NetR363_1: R363.1 Y4.3(OUT)

Not connected (* = marked no-connect by the designer): U54 C7(HHSB_CC1)* D7(HHSA_CC1)* E8(HHSB_CC2)* G9(HHSA_CC2)* K7(AUDIOCLK)*

### Layout directives
differential pair; differential pair class DIFF90; net class DIFF90: USBA_N, USBA_P, USBB_N, USBB_P, USBC_N, USBC_P
differential pair; net class DIFF100; differential pair class DIFF100: MIPI_CK_N, MIPI_CK_P, MIPI_D0_N, MIPI_D0_P, MIPI_D1_N, MIPI_D1_P

### Notes on the sheet
- Thêm CAN giữa 2 khối
- MPU configuration
- MPU decoupling
- (near C235) 1.15V
- host/device
- 3.3V
- host
- 1.15V
- 32.768KHz clock
- (near TP18) 24MHz clock
- (near C267) 3.3V
- (near C277) 2.5V
- Reset button
- (near JP14) nSTART button
- Project:
- Sub-system:
- Design by:
- Sheet title:
- Sheet
- of
- Checked by:
- Approved by:
- Revision:
- Document No:
- Size:
- Date:
- A3

### Library data of the parts
C235 C250 C266 C267 C280 = _CAP_C_High_2: CAP CHIP High Value
C236-C249 C251-C265 C268-C279 C281-C288 = _CAP_C_2: CAP CHIP
JP13 JP14 = JUMPER_1_1
R336-R364 R369 R370 R580 R581 R592 R593 = _RES_B_2: RES
TP18 = CON1759: as TP5 on sheet 06_SAMA7G54-PMIC; MCHP-ID: CON1759; Revision: A; Symbol: Test Point No BOM; Status: MCL Design; ComponentLink1Description: SVN Datasheet; ComponentLink2Description: Local Datasheet; ComponentLink3URL: C:\ALTIUM_WORK\00001_MCHP-CDB\Library\LibraryRefs\Test Point No BOM.SchLib; ComponentLink3Description: Open Symbol; ComponentLink4URL: C:\ALTIUM_WORK\00001_MCHP-CDB\Library\Footprints\TP_1mm_SMD.PcbLib; ComponentLink4Description: Open Footprint; ComponentLink5Description: Open Footprint 2; ComponentLink6Description: Open Footprint 3; ComponentLink7Description: Open Footprint 4; Type: Test Point; Category: Connector; Quantity Override: 1
U54 = MIC8923: SAMA7G54 MPU 1000MHz Cortex-A7 TFBGA-343; Manufacturer Part Number 1: SAMA7G54-V/4HB; Manufacturer 1: Microchip; Description_: MCHP MPU 32-BIT Cortex-A7 1000MHz 128kB SAMA7G54-V/4HB TFBGA-343; Populated: YES; Dev Tools Status: Design; Owner: Ciprian Abramov; Package: TFBGA-343; MCHP-ID: MIC8923; Value: SAMA7G54; Symbol: SAMA7G54 TFBGA-343; Type: 32-Bit MPU; Status: MCL Design; Revision: 1; Category: MCHP-Microcontroller; ComponentLink1Description: SVN Datasheet; ComponentLink2Description: Local Datasheet; ComponentLink3URL: C:\ALTIUM_WORK\00001_MCHP-CDB\Library\LibraryRefs\SAMA7G54 TFBGA-343.SchLib; ComponentLink3Description: Open Symbol; ComponentLink4URL: C:\ALTIUM_WORK\00001_MCHP-CDB\Library\Footprints\TFBGA-343_14x14.PcbLib; ComponentLink4Description: Open Footprint; ComponentLink5Description: Open Footprint 2; ComponentLink6Description: Open Footprint 3; ComponentLink7Description: Open Footprint 4; Supplier 1: Microchip; Supplier Part Number 1: SAMA7G54-V/4HB; Quantity Override: 1
Y1 = OSC1092: Crystal; Manufacturer 1: NDK; Description_: CRYSTAL 32.768kHz 12.5pF SMD NX2012SA; Dev Tools Status: Production; Owner: Jamus Griego; Tolerance: ±20ppm; Load Capacitance: 12.5pF; Populated: YES; MCHP-ID: OSC1092; Revision: 1; Symbol: Crystal 2 Pins; Status: MCL Design; ComponentLink1URL: https://chn-vm-apps.microchip.com/mchprepo/parts/Datasheets/c_NX2012SA-STD-MUB-1_e.pdf; ComponentLink1Description: SVN Datasheet; ComponentLink2URL: C:\ALTIUM_WORK\00001_MCHP-CDB\Datasheets\c_NX2012SA-STD-MUB-1_e.pdf; ComponentLink2Description: Local Datasheet; ComponentLink3URL: C:\ALTIUM_WORK\00001_MCHP-CDB\Library\LibraryRefs\Crystal 2 Pins.SchLib; ComponentLink3Description: Open Symbol; ComponentLink4URL: C:\ALTIUM_WORK\00001_MCHP-CDB\Library\Footprints\CRYSTAL_NX2012SA.PcbLib; ComponentLink4Description: Open Footprint; ComponentLink5Description: Open Footprint 2; ComponentLink6Description: Open Footprint 3; ComponentLink7Description: Open Footprint 4; Type: Crystal; Category: Crystal/Oscillator; Supplier 1: Digi-Key; Supplier Part Number 1: 644-1219-1-ND; Quantity Override: 1
Y2 = MIC6659: Manufacturer 1: Microchip Technology; Manufacturer Part Number 1: DSC1001DI5-024.0000T; Description_: MCHP CLOCK OSCILLATOR SINGLE 24MHz DSC1001DI5-024.0000 SMD-2520; Dev Tools Status: Design; Owner: Maurizio Gavardoni; Populated: YES; MCHP-ID: MIC6659; Revision: A; Symbol: DSC10xx DFN-4; Status: MCL Design; ComponentLink1Description: SVN Datasheet; ComponentLink2Description: Local Datasheet; ComponentLink3URL: C:\ALTIUM_WORK\00001_MCHP-CDB\Library\LibraryRefs\DSC10xx DFN-4.SchLib; ComponentLink3Description: Open Symbol; ComponentLink4URL: C:\ALTIUM_WORK\00001_MCHP-CDB\Library\Footprints\DFN-4_2.5x2.PcbLib; ComponentLink4Description: Open Footprint; ComponentLink5Description: Open Footprint 2; ComponentLink6Description: Open Footprint 3; ComponentLink7Description: Open Footprint 4; Category: MCHP-Clock/Timing; Type: Oscillator; Supplier 1: Digi-Key; Supplier Part Number 1: DSC1001DI5-024.0000T-ND; Quantity Override: 1
Y3 = OSC1047: Crystal; Manufacturer 1: Abracon Corporation; Description_: CRYSTAL 24MHz 18pF SMD ABM8G; Dev Tools Status: Production; Owner: Mark Loper; Populated: DNP; MCHP-ID: OSC1047; Revision: 1; Symbol: Crystal 4 Pins; Status: MCL Design; ComponentLink1URL: https://chn-vm-apps.microchip.com/mchprepo/parts/Datasheets/ABM8G.pdf; ComponentLink1Description: SVN Datasheet; ComponentLink2URL: C:\ALTIUM_WORK\00001_MCHP-CDB\Datasheets\ABM8G.pdf; ComponentLink2Description: Local Datasheet; ComponentLink3URL: C:\ALTIUM_WORK\00001_MCHP-CDB\Library\LibraryRefs\Crystal 4 Pins.SchLib; ComponentLink3Description: Open Symbol; ComponentLink4URL: C:\ALTIUM_WORK\00001_MCHP-CDB\Library\Footprints\CRYSTAL_ABM8G.PcbLib; ComponentLink4Description: Open Footprint; ComponentLink5Description: Open Footprint 2; ComponentLink6Description: Open Footprint 3; ComponentLink7Description: Open Footprint 4; Package: ABM8G; Type: Crystal; Category: Crystal/Oscillator; Supplier 1: Digi-Key; Supplier Part Number 1: 535-10273-1-ND; Quantity Override: 1
Y4 = MIC8888: Manufacturer 1: Microchip Technology; Manufacturer Part Number 1: DSC6003MA3B-032K768; Description_: MCHP CLOCK OSCILLATOR SINGLE 32.768KHz DSC6003MA3B-032K768 SMD DFN-4; Dev Tools Status: Design; Owner: Ciprian Abramov; Populated: DNP; MCHP-ID: MIC8888; Revision: 1; Symbol: DSC60xx DFN-4_LGA-4; Status: MCL Design; ComponentLink1Description: SVN Datasheet; ComponentLink2Description: Local Datasheet; ComponentLink3URL: C:\ALTIUM_WORK\00001_MCHP-CDB\Library\LibraryRefs\DSC60xx DFN-4_LGA-4.SchLib; ComponentLink3Description: Open Symbol; ComponentLink4URL: C:\ALTIUM_WORK\00001_MCHP-CDB\Library\Footprints\DFN-4_2x1.6.PcbLib; ComponentLink4Description: Open Footprint; ComponentLink5Description: Open Footprint 2; ComponentLink6Description: Open Footprint 3; ComponentLink7Description: Open Footprint 4; Category: MCHP-Clock/Timing; Type: Oscillator; Supplier 1: Digi-Key; Supplier Part Number 1: DSC6003MA3B-032K768-ND; Quantity Override: 1; Supplier 2: Mouser; Supplier Part Number 2: 579-6003MA3B032K768

## Sheet 06_SAMA7G54-PIO.SchDoc
size 420 x 297 mm; SheetNumber: 28; SheetTotal: 29
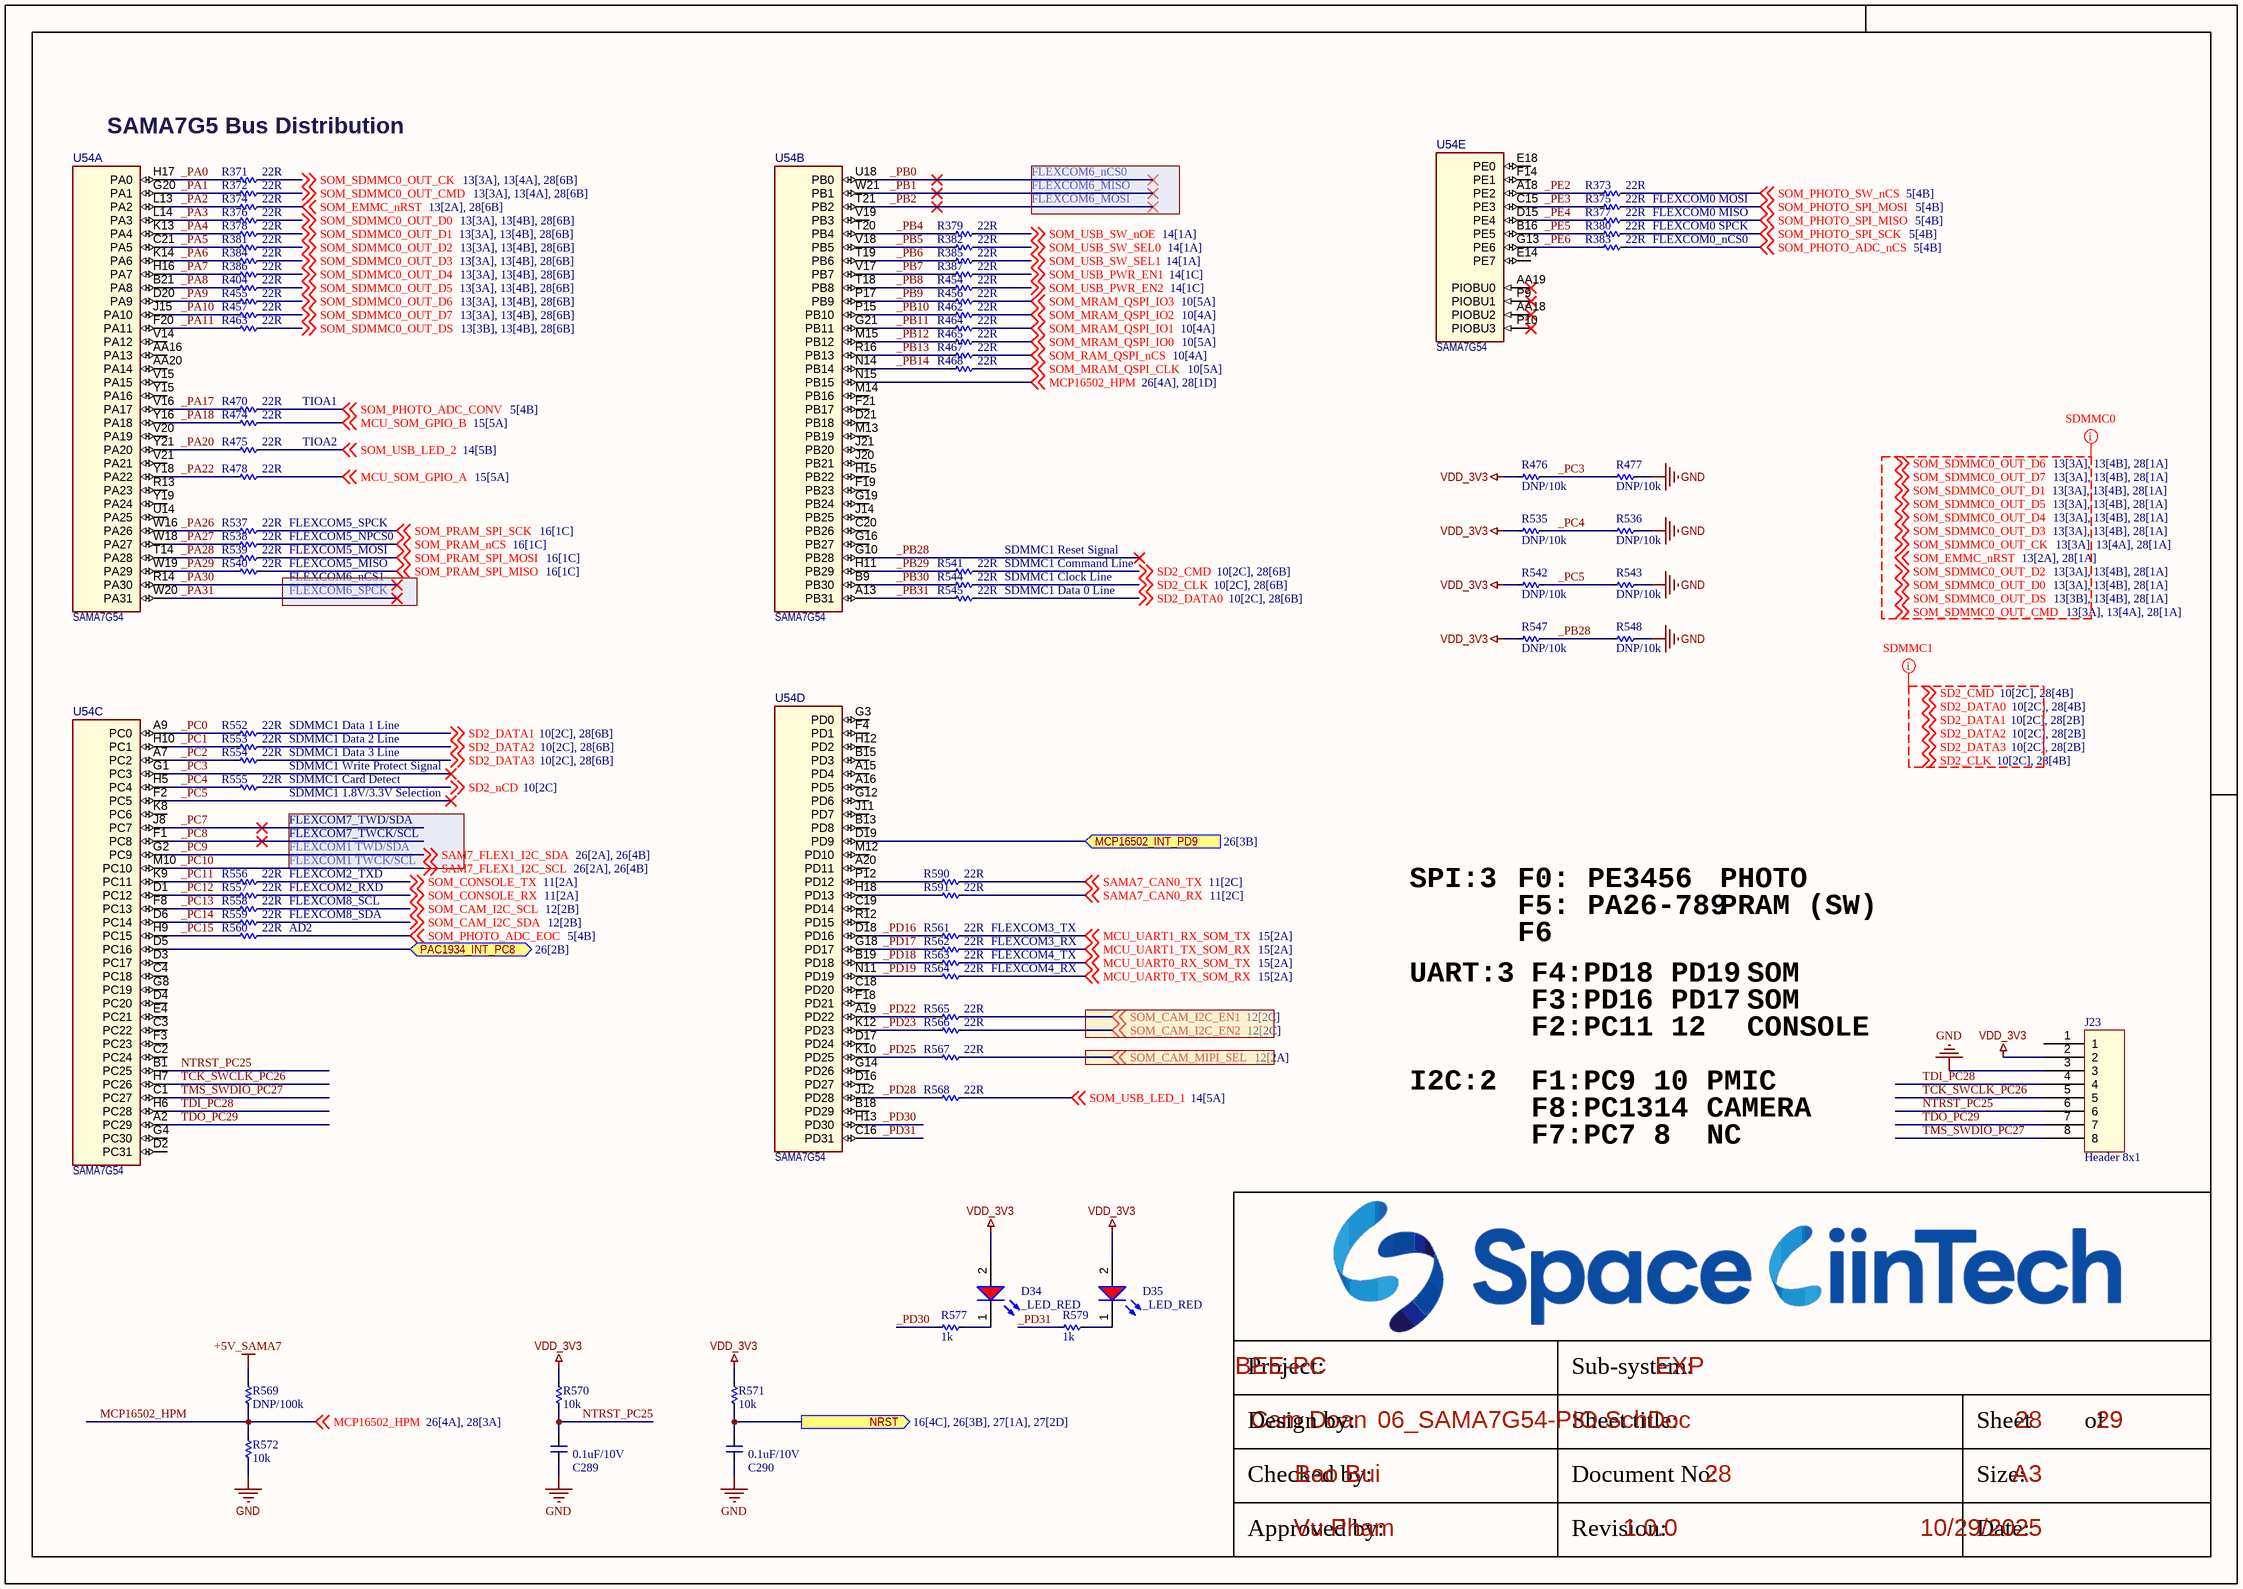
[diagram p34: 06_SAMA7G54-PIO.SchDoc]

### Parts
C289  0.1uF/10V  [CAP_C_1005X60]
C290  0.1uF/10V  [CAP_C_1005X60]
D34  _LED_RED  [LED_0603]
D35  _LED_RED  [LED_0603]
J23  Header 8x1  [Header_254P_8x1]
R371  22R  [RES_C_0603X30]
R372  22R  [RES_C_0603X30]
R373  22R  [RES_C_0603X30]
R374  22R  [RES_C_0603X30]
R375  22R  [RES_C_0603X30]
R376  22R  [RES_C_0603X30]
R377  22R  [RES_C_0603X30]
R378  22R  [RES_C_0603X30]
R379  22R  [RES_C_0603X30]
R380  22R  [RES_C_0603X30]
R381  22R  [RES_C_0603X30]
R382  22R  [RES_C_0603X30]
R383  22R  [RES_C_0603X30]
R384  22R  [RES_C_0603X30]
R385  22R  [RES_C_0603X30]
R386  22R  [RES_C_0603X30]
R387  22R  [RES_C_0603X30]
R404  22R  [RES_C_0603X30]
R454  22R  [RES_C_0603X30]
R455  22R  [RES_C_0603X30]
R456  22R  [RES_C_0603X30]
R457  22R  [RES_C_0603X30]
R462  22R  [RES_C_0603X30]
R463  22R  [RES_C_0603X30]
R464  22R  [RES_C_0603X30]
R465  22R  [RES_C_0603X30]
R467  22R  [RES_C_0603X30]
R468  22R  [RES_C_0603X30]
R470  22R  [RES_C_0603X30]
R474  22R  [RES_C_0603X30]
R475  22R  [RES_C_0603X30]
R476  DNP/10k  [RES_C_1005X40]
R477  DNP/10k  [RES_C_1005X40]
R478  22R  [RES_C_0603X30]
R535  DNP/10k  [RES_C_1005X40]
R536  DNP/10k  [RES_C_1005X40]
R537  22R  [RES_C_0603X30]
R538  22R  [RES_C_0603X30]
R539  22R  [RES_C_0603X30]
R540  22R  [RES_C_0603X30]
R541  22R  [RES_C_0603X30]
R542  DNP/10k  [RES_C_1005X40]
R543  DNP/10k  [RES_C_1005X40]
R544  22R  [RES_C_0603X30]
R545  22R  [RES_C_0603X30]
R547  DNP/10k  [RES_C_1005X40]
R548  DNP/10k  [RES_C_1005X40]
R552  22R  [RES_C_0603X30]
R553  22R  [RES_C_0603X30]
R554  22R  [RES_C_0603X30]
R555  22R  [RES_C_0603X30]
R556  22R  [RES_C_0603X30]
R557  22R  [RES_C_0603X30]
R558  22R  [RES_C_0603X30]
R559  22R  [RES_C_0603X30]
R560  22R  [RES_C_0603X30]
R561  22R  [RES_C_0603X30]
R562  22R  [RES_C_0603X30]
R563  22R  [RES_C_0603X30]
R564  22R  [RES_C_0603X30]
R565  22R  [RES_C_0603X30]
R566  22R  [RES_C_0603X30]
R567  22R  [RES_C_0603X30]
R568  22R  [RES_C_0603X30]
R569  DNP/100k  [RES_C_1005X40]
R570  10k  [RES_C_1005X40]
R571  10k  [RES_C_1005X40]
R572  10k  [RES_C_1005X40]
R577  1k  [RES_C_1005X40]
R579  1k  [RES_C_1005X40]
R590  22R  [RES_C_0603X30]
R591  22R  [RES_C_0603X30]
U54  SAMA7G54  [TFBGA-343_14x14]  (parts A,B,C,D,E of 8)

### Ports
MCP16502_INT_PD9 (in, see 26[3B]), NRST (out, see 16[4C], 26[3B], 27[1A], 27[2D]), PAC1934_INT_PC8 (bidir, see 26[2B])

### Nets
+5V_SAMA7: R569.1
GND: C289.1 C290.1 J23.3 R477.1 R536.1 R543.1 R548.1 R572.2
VDD_3V3: D34.2(A) D35.2(A) J23.2 R476.2 R535.2 R542.2 R547.2 R570.2 R571.2
_PA0: R371.2 U54.H17(PA0)
_PA1: R372.2 U54.G20(PA1)
_PA2: R374.2 U54.L13(PA2)
_PA3: R376.2 U54.L14(PA3)
_PA4: R378.2 U54.K13(PA4)
_PA5: R381.2 U54.C21(PA5)
_PA6: R384.2 U54.K14(PA6)
_PA7: R386.2 U54.H16(PA7)
_PA8: R404.2 U54.B21(PA8)
_PA9: R455.2 U54.D20(PA9)
_PA10: R457.2 U54.J15(PA10)
_PA11: R463.2 U54.F20(PA11)
_PA17: R470.2 U54.V16(PA17)
_PA18: R474.2 U54.Y16(PA18)
_PA20: R475.2 U54.Y21(PA20)
_PA22: R478.2 U54.Y18(PA22)
_PA26: R537.2 U54.W16(PA26)
_PA27: R538.2 U54.W18(PA27)
_PA28: R539.2 U54.T14(PA28)
_PA29: R540.2 U54.W19(PA29)
_PA30: U54.R14(PA30)
_PA31: U54.W20(PA31)
_PB0: U54.U18(PB0)
_PB1: U54.W21(PB1)
_PB2: U54.T21(PB2)
_PB4: R379.2 U54.T20(PB4)
_PB5: R382.2 U54.V18(PB5)
_PB6: R385.2 U54.T19(PB6)
_PB7: R387.2 U54.V17(PB7)
_PB8: R454.2 U54.T18(PB8)
_PB9: R456.2 U54.P17(PB9)
_PB10: R462.2 U54.P15(PB10)
_PB11: R464.2 U54.G21(PB11)
_PB12: R465.2 U54.M15(PB12)
_PB13: R467.2 U54.R16(PB13)
_PB14: R468.2 U54.N14(PB14)
_PB28: R547.1 R548.2 U54.G10(PB28)
_PB29: R541.2 U54.H11(PB29)
_PB30: R544.2 U54.B9(PB30)
_PB31: R545.2 U54.A13(PB31)
_PC0: R552.2 U54.A9(PC0)
_PC1: R553.2 U54.H10(PC1)
_PC2: R554.2 U54.A7(PC2)
_PC3: R476.1 R477.2 U54.G1(PC3)
_PC4: R535.1 R536.2 R555.2 U54.H5(PC4)
_PC5: R542.1 R543.2 U54.F2(PC5)
_PC7: U54.J8(PC7)
_PC8: U54.F1(PC8)
_PC9: U54.G2(PC9) ; off-sheet SAM7_FLEX1_I2C_SDA  [also labelled SAM7_FLEX1_I2C_SDA]
_PC10: U54.M10(PC10) ; off-sheet SAM7_FLEX1_I2C_SCL  [also labelled SAM7_FLEX1_I2C_SCL]
_PC11: R556.2 U54.K9(PC11)
_PC12: R557.2 U54.D1(PC12)
_PC13: R558.2 U54.F8(PC13)
_PC14: R559.2 U54.D6(PC14)
_PC15: R560.2 U54.H9(PC15)
_PD16: R561.2 U54.D18(PD16)
_PD17: R562.2 U54.G18(PD17)
_PD18: R563.2 U54.B19(PD18)
_PD19: R564.2 U54.N11(PD19)
_PD22: R565.2 U54.A19(PD22)
_PD23: R566.2 U54.K12(PD23)
_PD25: R567.2 U54.K10(PD25)
_PD28: R568.2 U54.J12(PD28)
_PD30: R577.1 U54.H13(PD30)
_PD31: R579.1 U54.C16(PD31)
_PE2: R373.2 U54.A18(PE2)
_PE3: R375.2 U54.C15(PE3)
_PE4: R377.2 U54.D15(PE4)
_PE5: R380.2 U54.B16(PE5)
_PE6: R383.2 U54.G13(PE6)
MCP16502_HPM: R569.2 R572.1 U54.N15(PB15) ; off-sheet MCP16502_HPM
MCU_SOM_GPIO_A: R478.1 ; off-sheet MCU_SOM_GPIO_A
MCU_SOM_GPIO_B: R474.1 ; off-sheet MCU_SOM_GPIO_B
MCU_UART0_RX_SOM_TX: R563.1 ; off-sheet MCU_UART0_RX_SOM_TX
MCU_UART0_TX_SOM_RX: R564.1 ; off-sheet MCU_UART0_TX_SOM_RX
MCU_UART1_RX_SOM_TX: R561.1 ; off-sheet MCU_UART1_RX_SOM_TX
MCU_UART1_TX_SOM_RX: R562.1 ; off-sheet MCU_UART1_TX_SOM_RX
NTRST_PC25: C289.2 J23.6 R570.1 U54.B1(PC25)
SAMA7_CAN0_RX: R591.1 ; off-sheet SAMA7_CAN0_RX
SAMA7_CAN0_TX: R590.1 ; off-sheet SAMA7_CAN0_TX
SD2_CLK: R544.1 ; off-sheet SD2_CLK
SD2_CMD: R541.1 ; off-sheet SD2_CMD
SD2_DATA0: R545.1 ; off-sheet SD2_DATA0
SD2_DATA1: R552.1 ; off-sheet SD2_DATA1
SD2_DATA2: R553.1 ; off-sheet SD2_DATA2
SD2_DATA3: R554.1 ; off-sheet SD2_DATA3
SD2_nCD: R555.1 ; off-sheet SD2_nCD
SOM_CAM_I2C_EN1: R565.1 ; off-sheet SOM_CAM_I2C_EN1
SOM_CAM_I2C_EN2: R566.1 ; off-sheet SOM_CAM_I2C_EN2
SOM_CAM_I2C_SCL: R558.1 ; off-sheet SOM_CAM_I2C_SCL
SOM_CAM_I2C_SDA: R559.1 ; off-sheet SOM_CAM_I2C_SDA
SOM_CAM_MIPI_SEL: R567.1 ; off-sheet SOM_CAM_MIPI_SEL
SOM_CONSOLE_RX: R557.1 ; off-sheet SOM_CONSOLE_RX
SOM_CONSOLE_TX: R556.1 ; off-sheet SOM_CONSOLE_TX
SOM_EMMC_nRST: R374.1 ; off-sheet SOM_EMMC_nRST
SOM_MRAM_QSPI_CLK: R468.1 ; off-sheet SOM_MRAM_QSPI_CLK
SOM_MRAM_QSPI_IO0: R465.1 ; off-sheet SOM_MRAM_QSPI_IO0
SOM_MRAM_QSPI_IO1: R464.1 ; off-sheet SOM_MRAM_QSPI_IO1
SOM_MRAM_QSPI_IO2: R462.1 ; off-sheet SOM_MRAM_QSPI_IO2
SOM_MRAM_QSPI_IO3: R456.1 ; off-sheet SOM_MRAM_QSPI_IO3
SOM_PHOTO_ADC_CONV: R470.1 ; off-sheet SOM_PHOTO_ADC_CONV
SOM_PHOTO_ADC_EOC: R560.1 ; off-sheet SOM_PHOTO_ADC_EOC
SOM_PHOTO_ADC_nCS: R383.1 ; off-sheet SOM_PHOTO_ADC_nCS
SOM_PHOTO_SPI_MISO: R377.1 ; off-sheet SOM_PHOTO_SPI_MISO
SOM_PHOTO_SPI_MOSI: R375.1 ; off-sheet SOM_PHOTO_SPI_MOSI
SOM_PHOTO_SPI_SCK: R380.1 ; off-sheet SOM_PHOTO_SPI_SCK
SOM_PHOTO_SW_nCS: R373.1 ; off-sheet SOM_PHOTO_SW_nCS
SOM_PRAM_nCS: R538.1 ; off-sheet SOM_PRAM_nCS
SOM_PRAM_SPI_MISO: R540.1 ; off-sheet SOM_PRAM_SPI_MISO
SOM_PRAM_SPI_MOSI: R539.1 ; off-sheet SOM_PRAM_SPI_MOSI
SOM_PRAM_SPI_SCK: R537.1 ; off-sheet SOM_PRAM_SPI_SCK
SOM_RAM_QSPI_nCS: R467.1 ; off-sheet SOM_RAM_QSPI_nCS
SOM_SDMMC0_OUT_CK: R371.1 ; off-sheet SOM_SDMMC0_OUT_CK
SOM_SDMMC0_OUT_CMD: R372.1 ; off-sheet SOM_SDMMC0_OUT_CMD
SOM_SDMMC0_OUT_D0: R376.1 ; off-sheet SOM_SDMMC0_OUT_D0
SOM_SDMMC0_OUT_D1: R378.1 ; off-sheet SOM_SDMMC0_OUT_D1
SOM_SDMMC0_OUT_D2: R381.1 ; off-sheet SOM_SDMMC0_OUT_D2
SOM_SDMMC0_OUT_D3: R384.1 ; off-sheet SOM_SDMMC0_OUT_D3
SOM_SDMMC0_OUT_D4: R386.1 ; off-sheet SOM_SDMMC0_OUT_D4
SOM_SDMMC0_OUT_D5: R404.1 ; off-sheet SOM_SDMMC0_OUT_D5
SOM_SDMMC0_OUT_D6: R455.1 ; off-sheet SOM_SDMMC0_OUT_D6
SOM_SDMMC0_OUT_D7: R457.1 ; off-sheet SOM_SDMMC0_OUT_D7
SOM_SDMMC0_OUT_DS: R463.1 ; off-sheet SOM_SDMMC0_OUT_DS
SOM_USB_LED_1: R568.1 ; off-sheet SOM_USB_LED_1
SOM_USB_LED_2: R475.1 ; off-sheet SOM_USB_LED_2
SOM_USB_PWR_EN1: R387.1 ; off-sheet SOM_USB_PWR_EN1
SOM_USB_PWR_EN2: R454.1 ; off-sheet SOM_USB_PWR_EN2
SOM_USB_SW_nOE: R379.1 ; off-sheet SOM_USB_SW_nOE
SOM_USB_SW_SEL0: R382.1 ; off-sheet SOM_USB_SW_SEL0
SOM_USB_SW_SEL1: R385.1 ; off-sheet SOM_USB_SW_SEL1
TCK_SWCLK_PC26: J23.5 U54.H7(PC26)
TDI_PC28: J23.4 U54.H6(PC28)
TDO_PC29: J23.7 U54.A2(PC29)
TMS_SWDIO_PC27: J23.8 U54.C1(PC27)
NetC290_2: C290.2 R571.1 ; port NRST
NetD34_1: D34.1(K) R577.2
NetD35_1: D35.1(K) R579.2
NetR318_2: U54.D5(PC16) ; port PAC1934_INT_PC8
NetR324_1: U54.D19(PD9) ; port MCP16502_INT_PD9
NetR590_2: R590.2 U54.P12(PD12)
NetR591_2: R591.2 U54.H18(PD13)

Not connected (* = marked no-connect by the designer): J23 1; U54 A15(PD4) A16(PD5) A20(PD11) AA16(PA13) AA18(PIOBU2)* AA19(PIOBU0)* AA20(PA14) B13(PD8) B15(PD3) B18(PD29) C2(PC24) C3(PC22) C4(PC18) C18(PD20) C19(PD14) C20(PB26) D2(PC31) D3(PC17) D4(PC20) D16(PD27) D17(PD24) D21(PB18) E4(PC21) E14(PE7) E18(PE0) F3(PC23) F4(PD1) F14(PE1) F18(PD21) F19(PB23) F21(PB17) G3(PD0) G4(PC30) G8(PC19) G12(PD6) G14(PD26) G16(PB27) G19(PB24) H12(PD2) H15(PB22) J11(PD7) J14(PB25) J20(PB21) J21(PB20) K8(PC6) M12(PD10) M13(PB19) M14(PB16) P9(PIOBU1)* P10(PIOBU3)* R12(PD15) R13(PA23) U14(PA25) V14(PA12) V15(PA15) V19(PB3) V20(PA19) V21(PA21) Y15(PA16) Y19(PA24)

### Layout directives
net class SDMMC1: SD2_CLK, SD2_CMD, SD2_DATA0, SD2_DATA1, SD2_DATA2, SD2_DATA3
net class SDMMC0: SOM_EMMC_nRST, SOM_SDMMC0_OUT_CK, SOM_SDMMC0_OUT_CMD, SOM_SDMMC0_OUT_D0, SOM_SDMMC0_OUT_D1, SOM_SDMMC0_OUT_D2, SOM_SDMMC0_OUT_D3, SOM_SDMMC0_OUT_D4, SOM_SDMMC0_OUT_D5, SOM_SDMMC0_OUT_D6, SOM_SDMMC0_OUT_D7, SOM_SDMMC0_OUT_DS

### Notes on the sheet
- SAMA7G5 Bus Distribution
- FLEXCOM6_MISO
- FLEXCOM6_nCS0
- FLEXCOM6_MOSI
- FLEXCOM0 MISO
- FLEXCOM0_nCS0
- FLEXCOM0 SPCK
- FLEXCOM0 MOSI
- TIOA1
- TIOA2
- FLEXCOM5_SPCK
- FLEXCOM6_SPCK
- FLEXCOM6_nCS1
- FLEXCOM5_NPCS0
- FLEXCOM5_MOSI
- FLEXCOM5_MISO
- SDMMC1 Reset Signal
- SDMMC1 Command Line
- SDMMC1 Data 0 Line
- SDMMC1 Clock Line
- SDMMC1 Data 1 Line
- SDMMC1 Data 2 Line
- SDMMC1 Data 3 Line
- SDMMC1 Write Protect Signal
- SDMMC1 Card Detect
- SDMMC1 1.8V/3.3V Selection
- FLEXCOM1 TWD/SDA
- FLEXCOM1 TWCK/SCL
- FLEXCOM7_TWD/SDA
- FLEXCOM7_TWCK/SCL
- AD2
- FLEXCOM8_SCL
- FLEXCOM8_SDA
- FLEXCOM2_TXD
- FLEXCOM2_RXD
- FLEXCOM3_TX
- SPI:3
- F0: PE3456
- F5: PA26-789
- PHOTO
- PRAM (SW)
- FLEXCOM3_RX
- FLEXCOM4_TX
- FLEXCOM4_RX
- UART:3
- F6
- F4:PD18 PD19
- SOM
- F3:PD16 PD17
- F2:PC11 12
- CONSOLE
- I2C:2
- F1:PC9 10
- F8:PC1314
- PMIC
- CAMERA
- F7:PC7 8
- NC
- Labels drawn without touching a wire or pin: SD2_CLK, SD2_CMD, SD2_DATA0, SD2_DATA1, SD2_DATA2, SD2_DATA3, SOM_EMMC_nRST, SOM_SDMMC0_OUT_CK, SOM_SDMMC0_OUT_CMD, SOM_SDMMC0_OUT_D0, SOM_SDMMC0_OUT_D1, SOM_SDMMC0_OUT_D2, SOM_SDMMC0_OUT_D3, SOM_SDMMC0_OUT_D4, SOM_SDMMC0_OUT_D5, SOM_SDMMC0_OUT_D6, SOM_SDMMC0_OUT_D7, SOM_SDMMC0_OUT_DS
- Project:
- Sub-system:
- Design by:
- Sheet title:
- Sheet
- of
- Checked by:
- Approved by:
- Revision:
- Document No:
- Size:
- Date:
- A3

### Library data of the parts
C289 C290 = _CAP_C_2: CAP CHIP
R371-R387 R404 R454-R457 R462-R465 R467 R468 R470 R474-R478 R535-R545 R547 R548 R552-R572 R577 R579 R590 R591 = _RES_B_2: RES
U54 = MIC8923: as U54 on sheet 06_SAMA7G54-MPU; Package: TFBGA-343; MCHP-ID: MIC8923; Value: SAMA7G54; Symbol: SAMA7G54 TFBGA-343; Type: 32-Bit MPU; Status: MCL Design; Revision: 1; Category: MCHP-Microcontroller; ComponentLink1Description: SVN Datasheet; ComponentLink2Description: Local Datasheet; ComponentLink3URL: C:\ALTIUM_WORK\00001_MCHP-CDB\Library\LibraryRefs\SAMA7G54 TFBGA-343.SchLib; ComponentLink3Description: Open Symbol; ComponentLink4URL: C:\ALTIUM_WORK\00001_MCHP-CDB\Library\Footprints\TFBGA-343_14x14.PcbLib; ComponentLink4Description: Open Footprint; ComponentLink5Description: Open Footprint 2; ComponentLink6Description: Open Footprint 3; ComponentLink7Description: Open Footprint 4; Supplier 1: Microchip; Supplier Part Number 1: SAMA7G54-V/4HB; Quantity Override: 1